# EAGLE board board (EAGLE 6.5.0), part 1 of 2
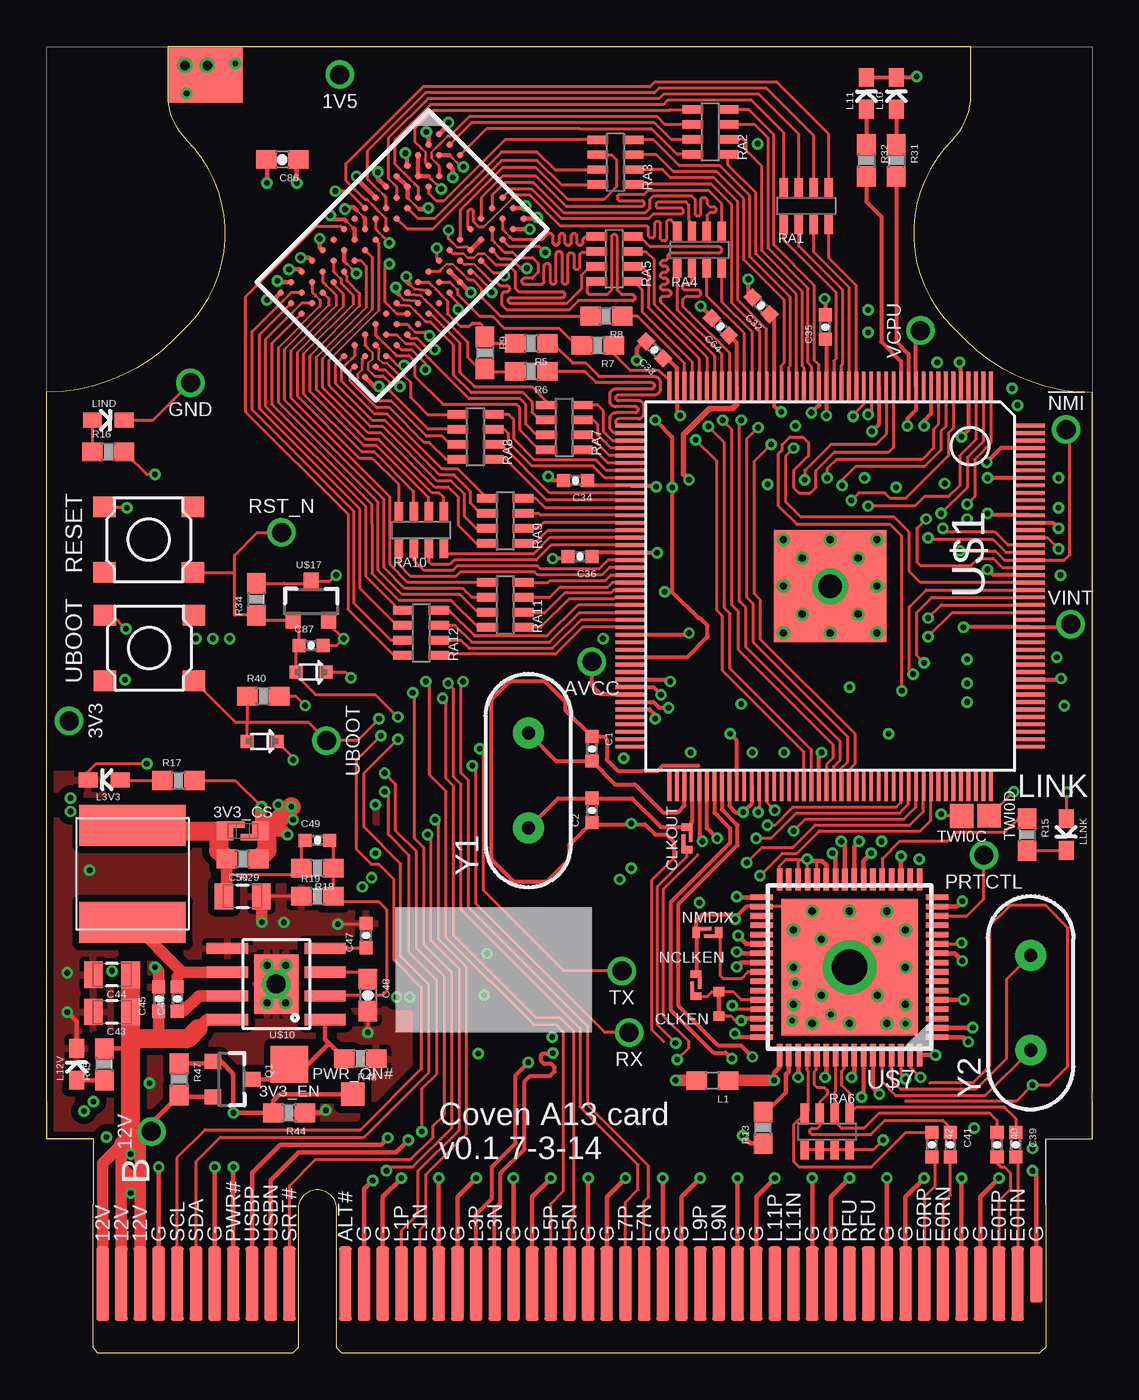
[diagram p3: board, top side]
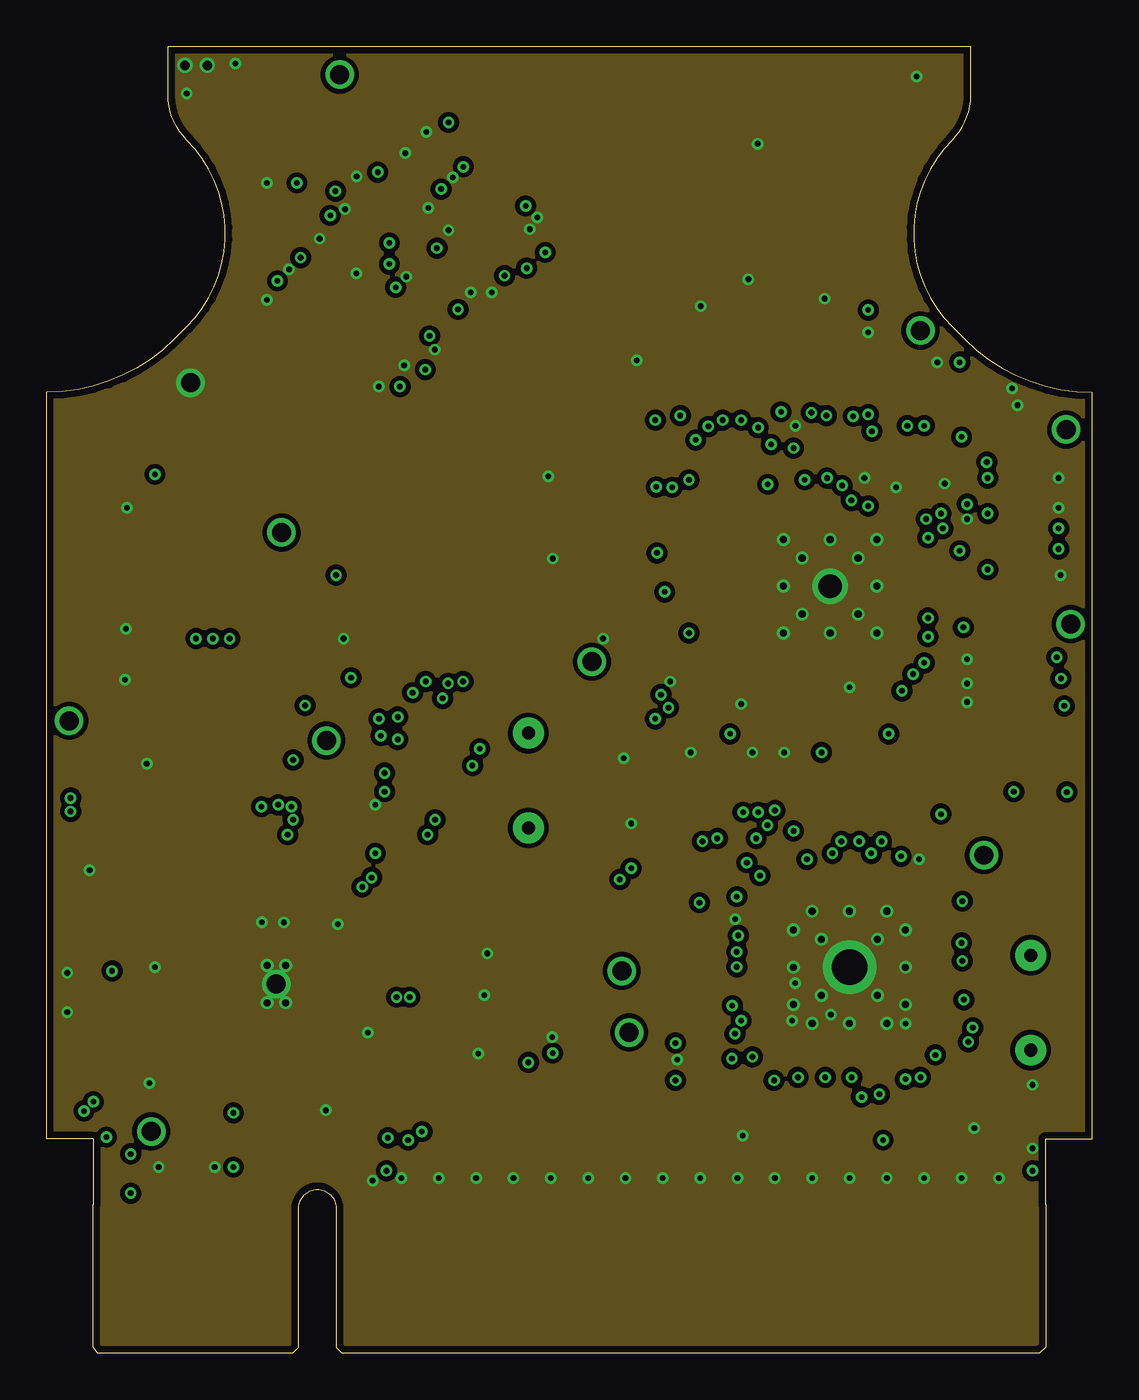
[diagram p4: board, inner layer Route2]
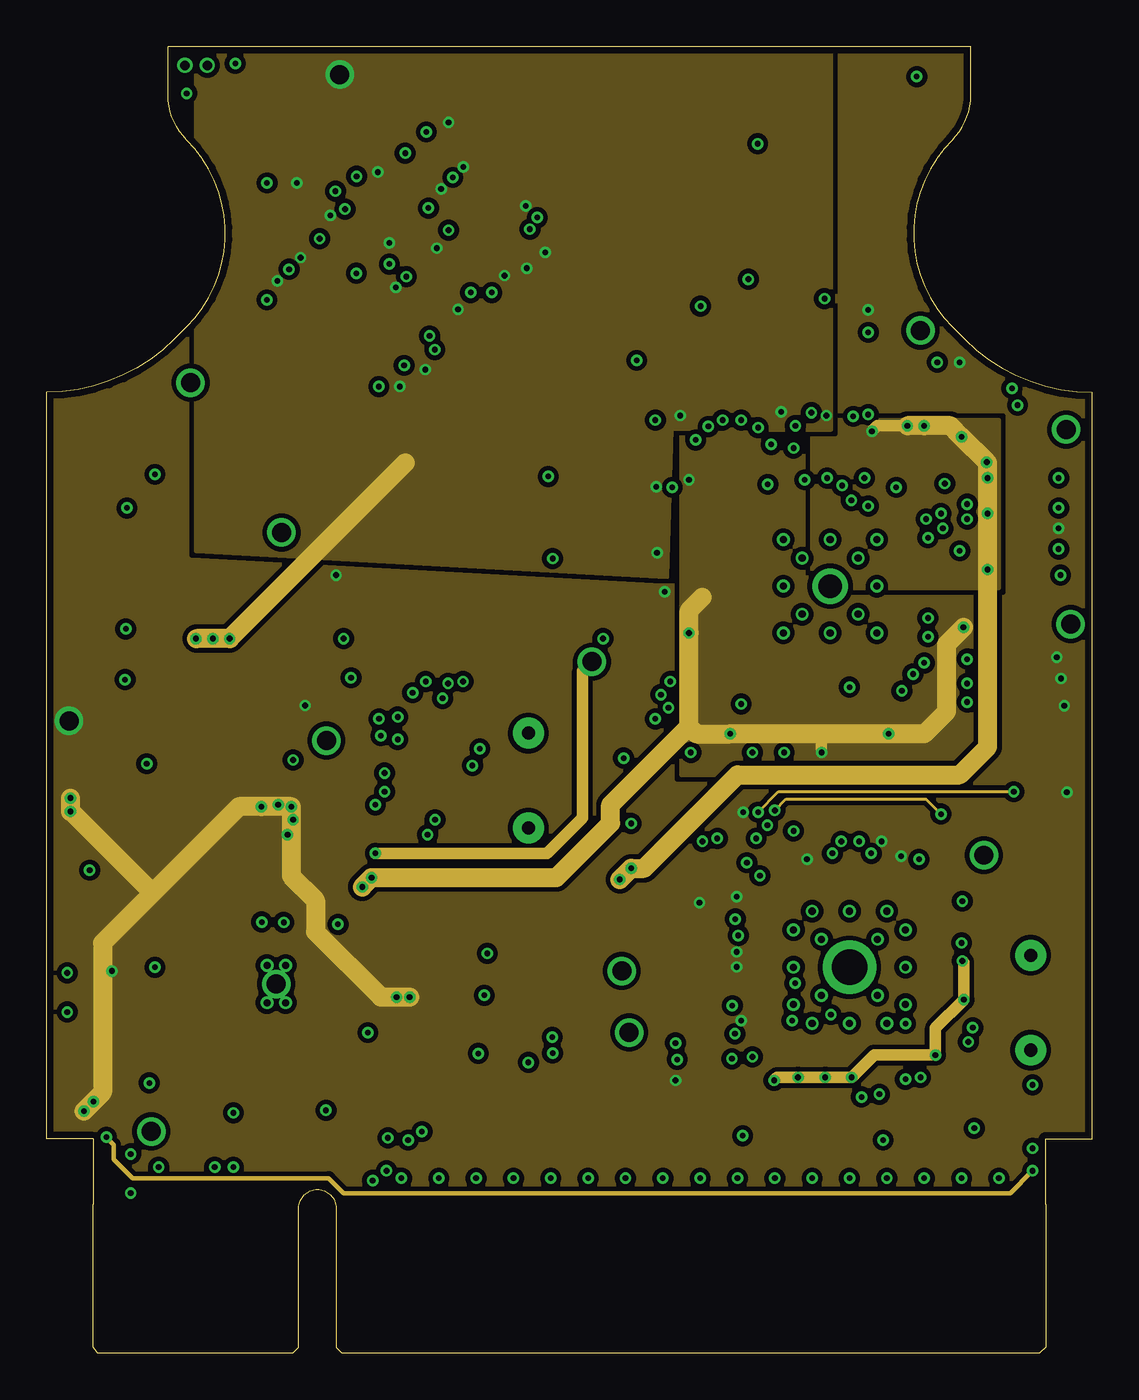
[diagram p5: board, inner layer Route15]
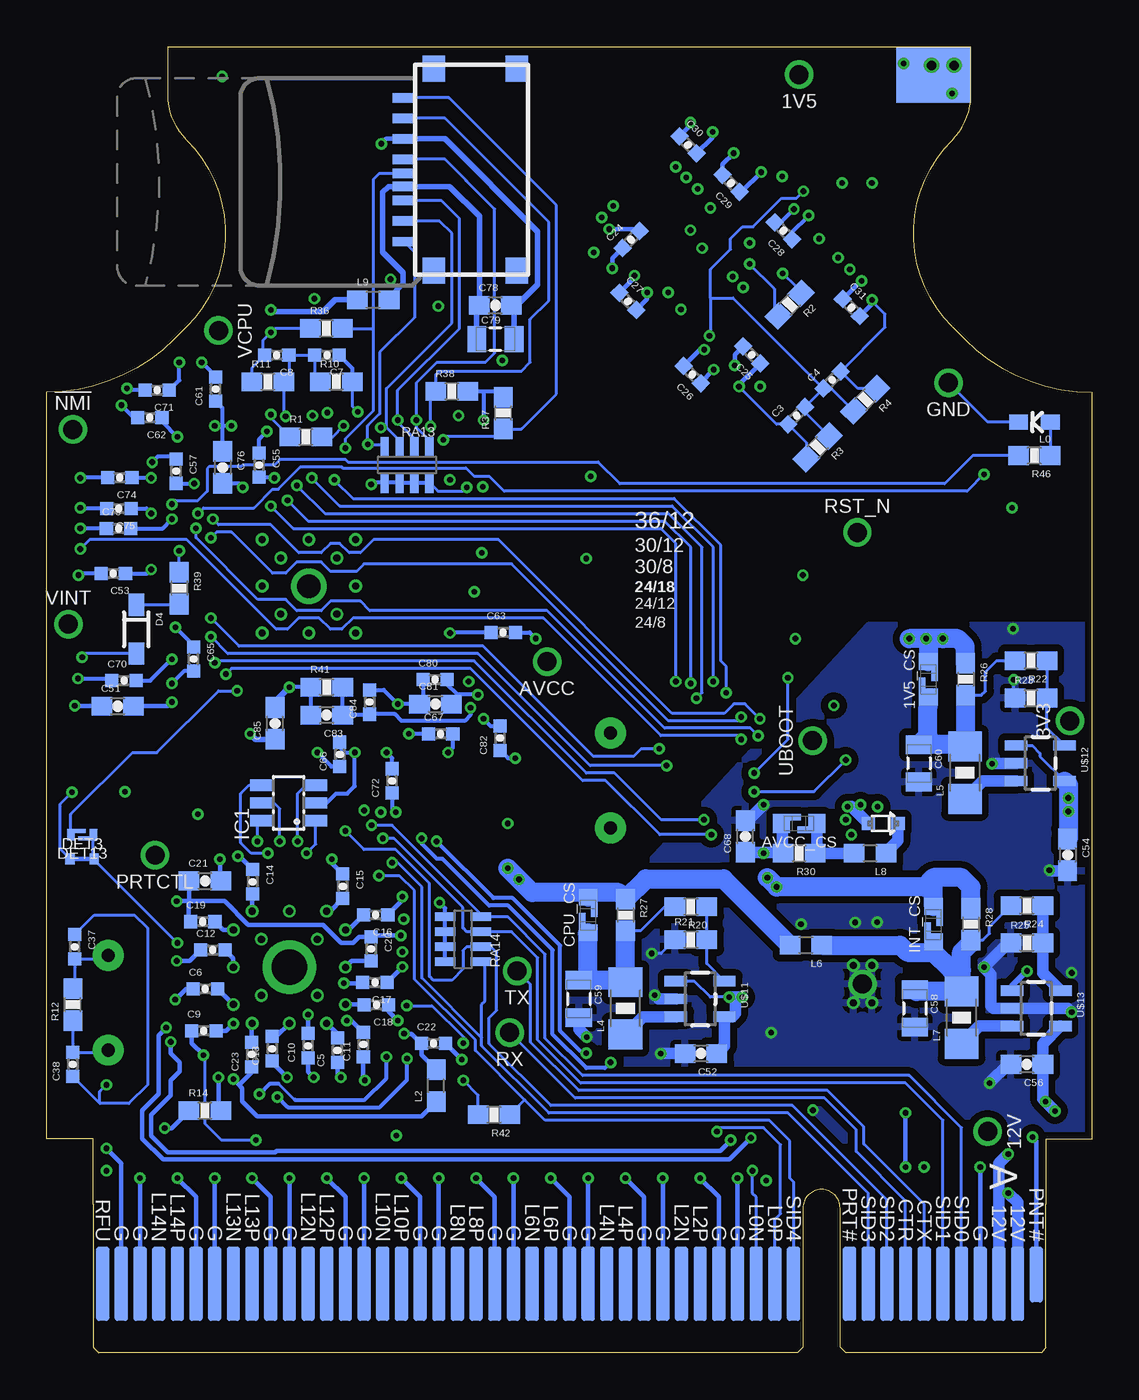
[diagram p6: board, bottom side, seen from below]

Size 56 x 69.95 mm. Coordinates in mm from the lower left corner, seen from the top.
Outline: 53.5,7.95 53.5,11.45 56,11.45 56,51.45 arc-45 49.17,54.28 48.5,54.95 arc-90 48.5,64.95 arc45 49.5,67.36 49.5,69.95 6.5,69.95 6.5,67.36 arc45 7.5,64.95 arc-90 7.5,54.95 6.83,54.28 arc-45 0,51.45 0,11.45 2.5,11.45 2.5,7.95
Copper layers (1*2*15*16): Top 0.035mm / dielectric 0.2mm / Route2 0.0175mm / dielectric 0.3mm / Route15 0.0175mm / dielectric 0.2mm / Bottom 0.035mm
Design rules "my_SeeedStudio_4layer_DRU_no_angle_20140221": minimum track width 6mil, minimum drill 12mil, track to track 6mil, track to pad 6mil, pad to pad 6mil, via to via 6mil, smd to smd 6mil, copper to edge 15mil, drill to drill 10mil, minimum pad ring 6mil, minimum via ring 6mil, stop-mask expansion 2mil, vias tented up to drill 12mil, thermal gap 10mil

## Footprints (pad centres in the part's own frame; a part is rotated, then mirrored left to right if it is on the bottom)
0402-CAP = smd 0.7 x 0.7: 1 -0.65,0; 2 0.65,0
0603-CAP = smd 1.1 x 1: 1 -0.85,0; 2 0.85,0
0805-CAP = smd 1 x 1.4: 1 -1,0; 2 1,0
HOLE_22AWG = drill 1.016: P 0,0
CLIP-AREA = smd 4 x 3: P$1 0,0 | smd 4 x 3 bottom: P$2 0,0
TESTPAD-1.27 = smd 1.27 x 1.27: P 0,0
TESTPAD-2MM = smd 2 x 2: P 0,0
SOD-523 = smd 0.7 x 0.7: A -0.8,0; C 0.8,0
SOD-323 = smd 1.2 x 0.83: A 1.3,0; C -1.3,0
BGA96 = smd 0.35 x 0.35: A1 -3.2,6; A2 -2.4,6; A3 -1.6,6; A7 1.6,6; A8 2.4,6; A9 3.2,6; B1 -3.2,5.2; B2 -2.4,5.2; B3 -1.6,5.2; B7 1.6,5.2; B8 2.4,5.2; B9 3.2,5.2; C1 -3.2,4.4; C2 -2.4,4.4; C3 -1.6,4.4; C7 1.6,4.4; C8 2.4,4.4; C9 3.2,4.4; D1 -3.2,3.6; D2 -2.4,3.6; D3 -1.6,3.6; D7 1.6,3.6; D8 2.4,3.6; D9 3.2,3.6; E1 -3.2,2.8; E2 -2.4,2.8; E3 -1.6,2.8; E7 1.6,2.8; E8 2.4,2.8; E9 3.2,2.8; F1 -3.2,2; F2 -2.4,2; F3 -1.6,2; F7 1.6,2; F8 2.4,2; F9 3.2,2; G1 -3.2,1.2; G2 -2.4,1.2; G3 -1.6,1.2; G7 1.6,1.2; G8 2.4,1.2; G9 3.2,1.2; H1 -3.2,0.4; H2 -2.4,0.4; H3 -1.6,0.4; H7 1.6,0.4; H8 2.4,0.4; H9 3.2,0.4; J1 -3.2,-0.4; J2 -2.4,-0.4; J3 -1.6,-0.4; J7 1.6,-0.4; J8 2.4,-0.4; J9 3.2,-0.4; K1 -3.2,-1.2; K2 -2.4,-1.2; K3 -1.6,-1.2; K7 1.6,-1.2; K8 2.4,-1.2; K9 3.2,-1.2; L1 -3.2,-2; L2 -2.4,-2; L3 -1.6,-2; L7 1.6,-2; L8 2.4,-2; L9 3.2,-2; M1 -3.2,-2.8; M2 -2.4,-2.8; M3 -1.6,-2.8; M7 1.6,-2.8; M8 2.4,-2.8; M9 3.2,-2.8; N1 -3.2,-3.6; N2 -2.4,-3.6; N3 -1.6,-3.6; N7 1.6,-3.6; N8 2.4,-3.6; N9 3.2,-3.6; P1 -3.2,-4.4; P2 -2.4,-4.4; P3 -1.6,-4.4; P7 1.6,-4.4; P8 2.4,-4.4; P9 3.2,-4.4; R1 -3.2,-5.2; R2 -2.4,-5.2; R3 -1.6,-5.2; R7 1.6,-5.2; R8 2.4,-5.2; R9 3.2,-5.2; T1 -3.2,-6; T2 -2.4,-6; T3 -1.6,-6; T7 1.6,-6; T8 2.4,-6; T9 3.2,-6
SOT23-6L = smd 0.6 x 1.2: 1 -0.95,-1.45; 2 0,-1.45; 3 0.95,-1.45; 4 0.95,1.45; 5 0,1.45; 6 -0.95,1.45
0603_LED = smd 0.8 x 1.003: A 0,-0.852; C 0,0.852
0603 = smd 1.1 x 1: 1 -0.85,0; 2 0.85,0
NR60XX = smd 2.2 x 5.7: P$1 2.6,0; P$2 -2.6,0
1206 = smd 1.6 x 1.8: 1 -1.4,0; 2 1.4,0
SOT23-3 = smd 0.8 x 0.9: 1 -0.95,-1; 2 0.95,-1; 3 0,1.1
0603-RES = smd 1.1 x 1: 1 -0.85,0; 2 0.85,0
0603-ARV = smd 0.45 x 1.1: 1 -1.2,-0.95; 2 -0.4,-0.95; 3 0.4,-0.95; 4 1.2,-0.95; 5 1.2,0.95; 6 0.4,0.95; 7 -0.4,0.95; 8 -1.2,0.95
TAC_SWITCH_SMD_4.5X4.5 = smd 1.2 x 1.1: 1 -2.375,1.75; 2 2.375,1.75; 3 -2.375,-1.75; 4 2.375,-1.75
SOLDER-BRIDGE-OPEN = smd 0.4 x 0.6: L1 -0.6,0; R1 0.6,0 | smd 0.6 x 0.2: L2 -0.1,0.2; R2 0.1,-0.2
TRACE-CUT = smd 0.5 x 0.6: L1 -0.65,0; R1 0.65,0
SOLDER-BRIDGE-OPEN-LARGE = smd 0.9 x 1: L1 -0.95,0; R1 0.95,0 | smd 0.6 x 0.35: L2 -0.2,0.325; R2 0.2,-0.325
TQFP176_0.4 = smd 1.6 x 0.2: 001 -10.7,8.6; 002 -10.7,8.2; 003 -10.7,7.8; 004 -10.7,7.4; 005 -10.7,7; 006 -10.7,6.6; 007 -10.7,6.2; 008 -10.7,5.8; 009 -10.7,5.4; 010 -10.7,5; 011 -10.7,4.6; 012 -10.7,4.2; 013 -10.7,3.8; 014 -10.7,3.4; 015 -10.7,3; 016 -10.7,2.6; 017 -10.7,2.2; 018 -10.7,1.8; 019 -10.7,1.4; 020 -10.7,1; 021 -10.7,0.6; 022 -10.7,0.2; 023 -10.7,-0.2; 024 -10.7,-0.6; 025 -10.7,-1; 026 -10.7,-1.4; 027 -10.7,-1.8; 028 -10.7,-2.2; 029 -10.7,-2.6; 030 -10.7,-3; 031 -10.7,-3.4; 032 -10.7,-3.8; 033 -10.7,-4.2; 034 -10.7,-4.6; 035 -10.7,-5; 036 -10.7,-5.4; 037 -10.7,-5.8; 038 -10.7,-6.2; 039 -10.7,-6.6; 040 -10.7,-7; 041 -10.7,-7.4; 042 -10.7,-7.8; 043 -10.7,-8.2; 044 -10.7,-8.6; 089 10.7,-8.6; 090 10.7,-8.2; 091 10.7,-7.8; 092 10.7,-7.4; 093 10.7,-7; 094 10.7,-6.6; 095 10.7,-6.2; 096 10.7,-5.8; 097 10.7,-5.4; 098 10.7,-5; 099 10.7,-4.6; 100 10.7,-4.2; 101 10.7,-3.8; 102 10.7,-3.4; 103 10.7,-3; 104 10.7,-2.6; 105 10.7,-2.2; 106 10.7,-1.8; 107 10.7,-1.4; 108 10.7,-1; 109 10.7,-0.6; 110 10.7,-0.2; 111 10.7,0.2; 112 10.7,0.6; 113 10.7,1; 114 10.7,1.4; 115 10.7,1.8; 116 10.7,2.2; 117 10.7,2.6; 118 10.7,3; 119 10.7,3.4; 120 10.7,3.8; 121 10.7,4.2; 122 10.7,4.6; 123 10.7,5; 124 10.7,5.4; 125 10.7,5.8; 126 10.7,6.2; 127 10.7,6.6; 128 10.7,7; 129 10.7,7.4; 130 10.7,7.8; 131 10.7,8.2; 132 10.7,8.6 | smd 0.2 x 1.6: 045 -8.6,-10.7; 046 -8.2,-10.7; 047 -7.8,-10.7; 048 -7.4,-10.7; 049 -7,-10.7; 050 -6.6,-10.7; 051 -6.2,-10.7; 052 -5.8,-10.7; 053 -5.4,-10.7; 054 -5,-10.7; 055 -4.6,-10.7; 056 -4.2,-10.7; 057 -3.8,-10.7; 058 -3.4,-10.7; 059 -3,-10.7; 060 -2.6,-10.7; 061 -2.2,-10.7; 062 -1.8,-10.7; 063 -1.4,-10.7; 064 -1,-10.7; 065 -0.6,-10.7; 066 -0.2,-10.7; 067 0.2,-10.7; 068 0.6,-10.7; 069 1,-10.7; 070 1.4,-10.7; 071 1.8,-10.7; 072 2.2,-10.7; 073 2.6,-10.7; 074 3,-10.7; 075 3.4,-10.7; 076 3.8,-10.7; 077 4.2,-10.7; 078 4.6,-10.7; 079 5,-10.7; 080 5.4,-10.7; 081 5.8,-10.7; 082 6.2,-10.7; 083 6.6,-10.7; 084 7,-10.7; 085 7.4,-10.7; 086 7.8,-10.7; 087 8.2,-10.7; 088 8.6,-10.7; 133 8.6,10.7; 134 8.2,10.7; 135 7.8,10.7; 136 7.4,10.7; 137 7,10.7; 138 6.6,10.7; 139 6.2,10.7; 140 5.8,10.7; 141 5.4,10.7; 142 5,10.7; 143 4.6,10.7; 144 4.2,10.7; 145 3.8,10.7; 146 3.4,10.7; 147 3,10.7; 148 2.6,10.7; 149 2.2,10.7; 150 1.8,10.7; 151 1.4,10.7; 152 1,10.7; 153 0.6,10.7; 154 0.2,10.7; 155 -0.2,10.7; 156 -0.6,10.7; 157 -1,10.7; 158 -1.4,10.7; 159 -1.8,10.7; 160 -2.2,10.7; 161 -2.6,10.7; 162 -3,10.7; 163 -3.4,10.7; 164 -3.8,10.7; 165 -4.2,10.7; 166 -4.6,10.7; 167 -5,10.7; 168 -5.4,10.7; 169 -5.8,10.7; 170 -6.2,10.7; 171 -6.6,10.7; 172 -7,10.7; 173 -7.4,10.7; 174 -7.8,10.7; 175 -8.2,10.7; 176 -8.6,10.7 | drill 1.27: P$1 0,0 | drill 0.381: P$2 -2.5,2.5; P$3 0,2.5; P$4 2.5,2.5; P$5 2.5,-2.5; P$6 1.5,-1.5; P$7 0,-2.5; P$8 -1.5,-1.5; P$9 -1.5,1.5; P$10 1.5,1.5; P$11 2.5,0; P$12 -2.5,-2.5; P$13 -2.5,0 | smd 6 x 6: PAD 0,0
QFN64 = smd 1.2 x 0.3: 001 -4.7,3.75; 002 -4.7,3.25; 003 -4.7,2.75; 004 -4.7,2.25; 005 -4.7,1.75; 006 -4.7,1.25; 007 -4.7,0.75; 008 -4.7,0.25; 009 -4.7,-0.25; 010 -4.7,-0.75; 011 -4.7,-1.25; 012 -4.7,-1.75; 013 -4.7,-2.25; 014 -4.7,-2.75; 015 -4.7,-3.25; 016 -4.7,-3.75; 033 4.7,-3.75; 034 4.7,-3.25; 035 4.7,-2.75; 036 4.7,-2.25; 037 4.7,-1.75; 038 4.7,-1.25; 039 4.7,-0.75; 040 4.7,-0.25; 041 4.7,0.25; 042 4.7,0.75; 043 4.7,1.25; 044 4.7,1.75; 045 4.7,2.25; 046 4.7,2.75; 047 4.7,3.25; 048 4.7,3.75 | smd 0.3 x 1.2: 017 -3.75,-4.7; 018 -3.25,-4.7; 019 -2.75,-4.7; 020 -2.25,-4.7; 021 -1.75,-4.7; 022 -1.25,-4.7; 023 -0.75,-4.7; 024 -0.25,-4.7; 025 0.25,-4.7; 026 0.75,-4.7; 027 1.25,-4.7; 028 1.75,-4.7; 029 2.25,-4.7; 030 2.75,-4.7; 031 3.25,-4.7; 032 3.75,-4.7; 049 3.75,4.7; 050 3.25,4.7; 051 2.75,4.7; 052 2.25,4.7; 053 1.75,4.7; 054 1.25,4.7; 055 0.75,4.7; 056 0.25,4.7; 057 -0.25,4.7; 058 -0.75,4.7; 059 -1.25,4.7; 060 -1.75,4.7; 061 -2.25,4.7; 062 -2.75,4.7; 063 -3.25,4.7; 064 -3.75,4.7 | drill 1.905: P$1 0,0 | drill 0.381: P$2 0,3; P$3 -2,3; P$4 -3,0; P$5 0,-3; P$6 3,0; P$7 2,3; P$8 2,-3; P$9 -2,-3; P$10 -3,2; P$11 -3,-2; P$12 3,-2; P$13 3,2; P$14 -1.5,1.5; P$15 1.5,1.5; P$16 1.5,-1.5; P$17 -1.5,-1.5 | smd 7.3 x 7.3: PAD 0,0
HTSOP8 = smd 0.61 x 2.21: 1 -1.905,-2.616; 2 -0.635,-2.616; 3 0.635,-2.616; 4 1.905,-2.616; 5 1.905,2.616; 6 0.635,2.616; 7 -0.635,2.616; 8 -1.905,2.616 | drill 1.016: P$1 0,0 | drill 0.381: P$2 -1,0.5; P$3 -1,-0.5; P$4 1,-0.5; P$5 1,0.5 | smd 3.2 x 2.4: PAD 0,0
SOT23-5 = smd 0.55 x 1.2: 1 -0.95,-1.3; 2 0,-1.3; 3 0.95,-1.3; 4 0.95,1.3; 5 -0.95,1.3
MICROSD-MOLEX-1050270001 = smd 0.5 x 1.2: G1 0.2,-6.65; P1 3.85,-6.65; P2 2.75,-6.65; P3 1.65,-6.65; P4 0.9,-6.65; P5 -0.55,-6.65; P6 -1.65,-6.65; P7 -2.75,-6.65; P8 -3.85,-6.65 | smd 1.4 x 1.2: SHELL1 -5.4,-0.6; SHELL2 5.4,-0.6; SHELL3 5.4,-5.05; SHELL4 -5.4,-5.05
CVN-V1-EDGE = smd 0.7 x 3 bottom: A1 -11.5,-0.25 | smd 0.7 x 4 bottom: A2 -10.5,-0.75; A3 -9.5,-0.75; A4 -8.5,-0.75; A5 -7.5,-0.75; A6 -6.5,-0.75; A7 -5.5,-0.75; A8 -4.5,-0.75; A9 -3.5,-0.75; A10 -2.5,-0.75; A11 -1.5,-0.75; A12 1.5,-0.75; A13 2.5,-0.75; A14 3.5,-0.75; A15 4.5,-0.75; A16 5.5,-0.75; A17 6.5,-0.75; A18 7.5,-0.75; A19 8.5,-0.75; A20 9.5,-0.75; A21 10.5,-0.75; A22 11.5,-0.75; A23 12.5,-0.75; A24 13.5,-0.75; A25 14.5,-0.75; A26 15.5,-0.75; A27 16.5,-0.75; A28 17.5,-0.75; A29 18.5,-0.75; A30 19.5,-0.75; A31 20.5,-0.75; A32 21.5,-0.75; A33 22.5,-0.75; A34 23.5,-0.75; A35 24.5,-0.75; A36 25.5,-0.75; A37 26.5,-0.75; A38 27.5,-0.75; A39 28.5,-0.75; A40 29.5,-0.75; A41 30.5,-0.75; A42 31.5,-0.75; A43 32.5,-0.75; A44 33.5,-0.75; A45 34.5,-0.75; A46 35.5,-0.75; A47 36.5,-0.75; A48 37.5,-0.75; A49 38.5,-0.75 | smd 0.7 x 4: B1 -11.5,-0.75; B2 -10.5,-0.75; B3 -9.5,-0.75; B4 -8.5,-0.75; B5 -7.5,-0.75; B6 -6.5,-0.75; B7 -5.5,-0.75; B8 -4.5,-0.75; B9 -3.5,-0.75; B10 -2.5,-0.75; B11 -1.5,-0.75; B12 1.5,-0.75; B13 2.5,-0.75; B14 3.5,-0.75; B15 4.5,-0.75; B16 5.5,-0.75; B17 6.5,-0.75; B18 7.5,-0.75; B19 8.5,-0.75; B20 9.5,-0.75; B21 10.5,-0.75; B22 11.5,-0.75; B23 12.5,-0.75; B24 13.5,-0.75; B25 14.5,-0.75; B26 15.5,-0.75; B27 16.5,-0.75; B28 17.5,-0.75; B29 18.5,-0.75; B30 19.5,-0.75; B31 20.5,-0.75; B32 21.5,-0.75; B33 22.5,-0.75; B34 23.5,-0.75; B35 24.5,-0.75; B36 25.5,-0.75; B37 26.5,-0.75; B38 27.5,-0.75; B39 28.5,-0.75; B40 29.5,-0.75; B41 30.5,-0.75; B42 31.5,-0.75; B43 32.5,-0.75; B44 33.5,-0.75; B45 34.5,-0.75; B46 35.5,-0.75; B47 36.5,-0.75; B48 37.5,-0.75 | smd 0.7 x 3: B49 38.5,-0.25
HC49US = drill 0.7 pad 1.651: 1 -2.54,0; 2 2.54,0

## Placement (x,y rotation side)
C1  22pF  [0402-CAP]  29.2,32.35 270 top
C2  22pF  [0402-CAP]  29.2,29.05 90 top
C3  0.1uF  [0402-CAP]  15.84,50.19 45 bottom
C4  0.1uF  [0402-CAP]  13.93,52.1 45 bottom
C5  0.1uF  [0402-CAP]  40.43,16.21 90 bottom
C6  0.1uF  [0402-CAP]  47.5,19.49 0 bottom
C7  0.1uF  [0402-CAP]  40.99,53.43 180 bottom
C8  0.1uF  [0402-CAP]  43.68,53.43 180 bottom
C9  0.1uF  [0402-CAP]  47.58,17.25 0 bottom
C10  0.1uF  [0402-CAP]  42,16.45 90 bottom
C11  0.1uF  [0402-CAP]  39.04,16.51 90 bottom
C12  0.1uF  [0402-CAP]  47.1,21.57 0 bottom
C13  0.1uF  [0402-CAP]  43.92,16.29 90 bottom
C14  0.1uF  [0402-CAP]  44.96,25.23 270 bottom
C15  0.1uF  [0402-CAP]  40.14,24.99 270 bottom
C16  0.1uF  [0402-CAP]  38.38,23.45 180 bottom
C17  0.1uF  [0402-CAP]  38.42,19.83 180 bottom
C18  0.1uF  [0402-CAP]  38.34,18.63 180 bottom
C19  0.1uF  [0402-CAP]  47.64,23.09 0 bottom
C20  0.1uF  [0402-CAP]  38.62,21.63 270 bottom
C21  4.7uF  [0603-CAP]  47.52,25.27 0 bottom
C22  0.1uF  [0402-CAP]  35.28,16.57 0 bottom
C23  1uF  [0402-CAP]  45.02,15.97 90 bottom
C24  0.1uF  [0402-CAP]  24.7,59.62 45 bottom
C25  1uF  [0402-CAP]  18.24,53.45 135 bottom
C26  0.1uF  [0402-CAP]  21.42,52.38 135 bottom
C27  0.1uF  [0402-CAP]  24.87,56.31 315 bottom
C28  0.1uF  [0402-CAP]  16.54,60.09 135 bottom
C29  0.1uF  [0402-CAP]  19.35,62.63 135 bottom
C30  0.1uF  [0402-CAP]  21.65,64.69 315 bottom
C31  1uF  [0402-CAP]  12.91,55.98 315 bottom
C32  0.1uF  [0402-CAP]  38.26,56.08 135 top
C33  0.1uF  [0402-CAP]  32.56,53.71 135 top
C34  0.1uF  [0402-CAP]  28.32,46.72 180 top
C35  0.1uF  [0402-CAP]  41.7,54.94 90 top
C36  0.1uF  [0402-CAP]  28.56,42.64 180 top
C37  22pF  [0402-CAP]  54.5,21.75 270 bottom
C38  22pF  [0402-CAP]  54.6,15.45 90 bottom
C39  0.1uF  [0402-CAP]  51.9,11.15 270 top
C40  0.1uF  [0402-CAP]  50.9,11.15 270 top
C41  0.1uF  [0402-CAP]  48.4,11.15 270 top
C42  0.1uF  [0402-CAP]  47.4,11.15 270 top
C43  10uF  [0805-CAP]  3.5,18.25 180 top
C44  10uF  [0805-CAP]  3.5,20.25 180 top
C45  0.1uF  [0402-CAP]  6,18.95 90 top
C46  0.1uF  [0402-CAP]  7,18.95 90 top
C47  3300pF  [0402-CAP]  17.1,22.35 90 top
C48  1uF  [0603-CAP]  17.2,19.15 270 top
C49  5pF-100pF;optional  [0402-CAP]  14.5,27.45 0 top
C50  22uF  [0805-CAP]  10.5,24.45 0 top
C51  4.7uF  [0603-CAP]  52.2,34.63 0 bottom
C52  10uF  [0603-CAP]  20.96,16.03 180 bottom
C53  0.1uF  [0402-CAP]  52.43,41.74 180 bottom
C54  10uF  [0603-CAP]  1.32,26.67 270 bottom
C55  0.1uF  [0402-CAP]  44.62,47.54 270 bottom
C56  10uF  [0603-CAP]  3.5,15.45 180 bottom
C57  0.1uF  [0402-CAP]  49.07,47.21 270 bottom
C58  22uF  [0805-CAP]  9.5,18.45 270 bottom
C59  22uF  [0805-CAP]  27.5,18.95 270 bottom
C60  22uF  [0805-CAP]  9.28,31.57 270 bottom
C61  0.1uF  [0402-CAP]  46.96,51.61 90 bottom
C62  0.1uF  [0402-CAP]  50.48,50.08 180 bottom
C63  0.1uF  [0402-CAP]  31.55,38.58 0 bottom
C64  0.1uF  [0402-CAP]  36.08,54.96 135 top
C65  0.1uF  [0402-CAP]  48.13,37.16 270 bottom
C66  0.1uF  [0402-CAP]  40.3,32.05 90 bottom
C67  0.1uF  [0402-CAP]  34.9,33.15 0 bottom
C68  10uF  [0603-CAP]  18.58,27.65 90 bottom
C70  0.1uF  [0402-CAP]  51.86,36 0 bottom
C71  0.1uF  [0402-CAP]  50.08,51.55 180 bottom
C72  0.1uF  [0402-CAP]  37.5,30.63 90 bottom
C73  0.1uF  [0402-CAP]  52.15,44.15 0 bottom
C74  0.1uF  [0402-CAP]  52.09,46.87 180 bottom
C75  0.1uF  [0402-CAP]  52.13,45.21 180 bottom
C76  4.7uF  [0603-CAP]  46.57,47.42 270 bottom
C78  10uF  [0603-CAP]  31.97,56.09 0 bottom
C79  22uF  [0805-CAP]  31.97,54.29 0 bottom
C80  0.1uF  [0402-CAP]  35.2,36.05 0 bottom
C81  10uF  [0603-CAP]  35.18,34.74 0 bottom
C82  1uF  [0402-CAP]  31.72,32.92 90 bottom
C83  10uF  [0603-CAP]  41,34.15 180 bottom
C84  0.1uF  [0402-CAP]  38.7,34.85 90 bottom
C85  4.7uF  [0603-CAP]  43.77,33.71 90 bottom
C86  4.7uF  [0603-CAP]  12.62,63.9 180 top
C87  0.1uF  [0402-CAP]  14.16,37.87 0 top
CONN1  3V3  [HOLE_22AWG]  1.2,33.85 90 top
CONN2  VCPU  [HOLE_22AWG]  46.8,54.75 270 top
CONN3  VINT  [HOLE_22AWG]  54.84,39.02 180 top
CONN4  1V5  [HOLE_22AWG]  15.7,68.45 0 top
CONN5  GND  [HOLE_22AWG]  7.7,51.95 0 top
CONN6  12V  [HOLE_22AWG]  5.6,11.85 270 top
CONN7  AVCC  [HOLE_22AWG]  29.2,37.01 0 top
CONN8  gnd  [CLIP-AREA]  8.5,68.45 0 top
CONN9  PRTCTL  [HOLE_22AWG]  50.2,26.65 0 top
CONN10  TX  [HOLE_22AWG]  30.8,20.45 0 top
CONN11  UBOOT  [HOLE_22AWG]  14.98,32.79 90 top
CONN12  PWR_ON#  [TESTPAD-1.27]  16.4,13.85 180 top
CONN13  3V3_EN  [TESTPAD-2MM]  13,15.45 0 top
CONN14  !NMI  [HOLE_22AWG]  54.6,49.45 180 top
CONN15  TWI0C  [TESTPAD-1.27]  49,28.75 0 top
CONN16  TWI0D  [TESTPAD-1.27]  50.48,28.77 90 top
CONN17  RST_N  [HOLE_22AWG]  12.58,43.93 180 top
CONN18  RX  [HOLE_22AWG]  31.2,17.15 0 top
D1  RB521S30  [SOD-523]  14.16,36.45 0 top
D2  RB521S30  [SOD-523]  11.54,32.75 0 top
D4  B5819WS  [SOD-323]  51.2,38.75 270 bottom
D6  PMEG2010AEB  [SOD-523]  11.2,28.35 0 bottom
DDR3_1  x16, 96FBGA: AS4C{64/128/256}M16D3  [BGA96]  19.03,58.76 315 top
IC1  256/512 x 8bit  [SOT23-6L]  43.04,29.45 90 bottom
L0  WHT  [0603_LED]  3.1,49.85 90 bottom
L1  2A,120R@100MHz  [0603]  35.66,14.57 180 top
L2  2A,120R@100MHz  [0603]  35.14,14.31 90 bottom
L3  3.5A,2.2uH:NR6028T3R0N  [NR60XX]  4.6,25.65 270 top
L3V3  GRN  [0603_LED]  3.08,30.69 90 top
L4  1.5A,2.2uH:BRL3225T2R2M  [1206]  25,18.45 90 bottom
L5  1.5A,2.2uH:BRL3225T2R2M  [1206]  6.82,31.07 90 bottom
L6  DNP(2A,120R@100MHz)  [0603]  15.34,21.83 180 bottom
L7  1.5A,2.2uH:BRL3225T2R2M  [1206]  7,17.95 90 bottom
L8  2A,120R@100MHz  [0603]  11.9,26.75 180 bottom
L9  CIC10J601(750mA,600R)  [0603]  38.51,56.39 0 bottom
L10  GRN  [0603_LED]  45.5,67.45 0 top
L11  YLW  [0603_LED]  43.9,67.45 0 top
L12V  YLW  [0603_LED]  1.6,15.45 0 top
LIND  BLU  [0603_LED]  3.3,49.95 270 top
LLNK  GRN  [0603_LED]  54.6,27.75 180 top
Q1  2N7002  [SOT23-3]  9.9,14.65 270 top
R1  240R 1%  [0603-RES]  42.12,49.05 0 bottom
R2  240R 1%  [0603-RES]  16.21,56.14 225 bottom
R3  1k 1%  [0603-RES]  14.71,48.5 225 bottom
R4  1k 1%  [0603-RES]  12.16,51.04 225 bottom
R5  22R  [0603-RES]  25.96,54.06 180 top
R6  22R  [0603-RES]  25.96,52.56 180 top
R7  22R  [0603-RES]  29.52,53.95 180 top
R8  22R  [0603-RES]  29.98,55.52 180 top
R9  100R  [0603-RES]  23.46,53.56 270 top
R10  1k 1%  [0603-RES]  40.48,52.01 0 bottom
R11  1k 1%  [0603-RES]  44.15,52 0 bottom
R12  1M  [0603-RES]  54.6,18.65 90 bottom
R13  12.4K 1%  [0603-RES]  38.38,12.05 90 top
R14  12K 1%  [0603-RES]  47.52,12.97 0 bottom
R15  330R  [0603-RES]  52.5,27.75 270 top
R16  1k  [0603-RES]  3.3,48.25 0 top
R17  680R  [0603-RES]  7.06,30.65 0 top
R18  33k 1%  [0603-RES]  14.5,25.95 180 top
R19  10k 1%  [0603-RES]  14.5,24.45 0 top
R20  10k/12k 1%  [0603-RES]  21.5,23.89 180 bottom
R21  10k 1%  [0603-RES]  21.5,22.13 0 bottom
R22  15k 1%  [0603-RES]  3.28,37.07 180 bottom
R23  10k 1%  [0603-RES]  3.28,35.07 0 bottom
R24  10k/12k 1%  [0603-RES]  3.5,23.95 180 bottom
R25  10k 1%  [0603-RES]  3.5,21.95 0 bottom
R26  0.01R  [0603-RES]  6.78,36.07 270 bottom
R27  0.01R  [0603-RES]  25,23.45 270 bottom
R28  0.01R  [0603-RES]  6.5,22.95 270 bottom
R29  0.01R  [0603-RES]  10.5,26.45 180 top
R30  0.01R  [0603-RES]  15.7,26.75 180 bottom
R31  470R  [0603-RES]  45.5,63.85 270 top
R32  470R  [0603-RES]  43.9,63.85 270 top
R34  10k  [0603-RES]  11.24,40.35 90 top
R36  10k  [0603-RES]  41.02,54.86 0 bottom
R37  47k  [0603-RES]  31.54,50.33 90 bottom
R38  47k  [0603-RES]  34.3,51.49 0 bottom
R39  47k  [0603-RES]  48.9,40.95 270 bottom
R40  100k  [0603-RES]  11.6,35.17 0 top
R41  200k 1%  [0603-RES]  41,35.65 0 bottom
R42  10k  [0603-RES]  32.04,12.75 180 bottom
R44  100k  [0603-RES]  12.98,12.85 180 top
R45  4.7k  [0603-RES]  3.1,15.45 90 top
R46  1k  [0603-RES]  3.1,48.05 180 bottom
R47  330k  [0603-RES]  7.1,14.65 270 top
R48  DNP  [0603-RES]  16.8,15.75 180 top
RA1  22R  [0603-ARV]  40.68,61.42 0 top
RA2  22R  [0603-ARV]  35.54,65.38 90 top
RA3  22R  [0603-ARV]  30.46,63.76 90 top
RA4  22R  [0603-ARV]  34.96,59.07 0 top
RA5  22R  [0603-ARV]  30.4,58.59 90 top
RA6  49.9R 1%  [0603-ARV]  41.8,11.85 180 top
RA7  22R  [0603-ARV]  27.72,49.56 90 top
RA8  22R  [0603-ARV]  22.96,49.06 90 top
RA9  22R  [0603-ARV]  24.56,44.56 90 top
RA10  22R  [0603-ARV]  20.06,44.06 0 top
RA11  22R  [0603-ARV]  24.56,40.06 90 top
RA12  22R  [0603-ARV]  20.06,38.56 90 top
RA13  47k  [0603-ARV]  36.7,47.55 180 bottom
RA14  10k  [0603-ARV]  33.7,22.15 90 bottom
S_RESET  TAC_SWITCHSMD_4.5X4.5  [TAC_SWITCH_SMD_4.5X4.5]  5.46,43.55 0 top
SB1  NMDIX  [SOLDER-BRIDGE-OPEN]  35.4,22.51 0 top
SB3  NCLKEN  [SOLDER-BRIDGE-OPEN]  34.78,19.69 270 top
SB4  CLKEN  [TRACE-CUT]  36,18.69 90 top
SB5  CLKOUT  [SOLDER-BRIDGE-OPEN]  34.3,27.55 270 top
SB6  DET13  [SOLDER-BRIDGE-OPEN]  54.1,27.75 0 bottom
SB7  DET3  [TRACE-CUT]  54.1,26.45 0 bottom
SB8  3V3_CS  [SOLDER-BRIDGE-OPEN-LARGE]  10.5,27.95 0 top
SB9  CPU_CS  [SOLDER-BRIDGE-OPEN-LARGE]  27,23.45 90 bottom
SB10  1V5_CS  [SOLDER-BRIDGE-OPEN-LARGE]  8.78,36.07 90 bottom
SB11  AVCC_CS  [SOLDER-BRIDGE-OPEN-LARGE]  15.7,28.35 180 bottom
SB12  INT_CS  [SOLDER-BRIDGE-OPEN-LARGE]  8.5,22.95 90 bottom
SW_UBOOT  TAC_SWITCHSMD_4.5X4.5  [TAC_SWITCH_SMD_4.5X4.5]  5.5,37.75 0 top
U$1  A13  [TQFP176_0.4]  41.96,41.06 270 top
U$7  LAN9512  [QFN64]  43,20.65 180 top
U$10  BD9D321EFJ  [HTSOP8]  12.3,19.75 90 top
U$11  AP3418  [SOT23-5]  21,18.95 270 bottom
U$12  AP3418  [SOT23-5]  2.78,31.57 270 bottom
U$13  AP3418  [SOT23-5]  3,18.45 270 bottom
U$15  Molex 1050270001  [MICROSD-MOLEX-1050270001]  30.22,63.36 270 bottom
U$16  CVN-V1EDGE  [CVN-V1-EDGE]  14.5,4.45 0 top
U$17  RT9818C-29GV  [SOT23-3]  14.16,40.23 0 top
Y1  24MHz  [HC49US]  25.8,30.65 90 top
Y2  25MHz  [HC49US]  52.7,18.75 90 top

## Tracks (layer width: path | path; a pad name or v marks a point on that pad's centre or on a via)
1.5V  (via drill 0.3)
  Top 0.127: 16.43,60.23 16.04,60.63 | 18.86,56.67 19.15,56.39
  Top 0.14: 17.79,60.01 18.02,59.78 | 20.62,62.84 20.84,62.61 | 21.75,63.97 21.98,63.74
  Top 0.152: C35.1 41.76,54.23 | 41.76,54.23 | 18.92,51.86 18.13,52.65 17.79,52.65 DDR3_1.R9 | v20.28,52.65 20.28,52.99 19.54,53.73 18.98,53.73 DDR3_1.N9 | 19.77,56.33 19.15,56.39 | v22.03,55.88 22.03,56.22 21.58,56.67 DDR3_1.H9 | v20.9,59.16 20.9,58.59 DDR3_1.G7 | v24.52,57.69 24.35,57.86 23.9,57.86 DDR3_1.E9 | 25.54,61.31 v25.65,61.42 | v25.71,58.08 25.37,58.08 24.86,58.59 24.29,58.59 DDR3_1.D9 | v26.7,58.93 26.36,59.27 24.75,59.27 DDR3_1.C9 | 17.79,60.01 17.62,60.18 DDR3_1.H2 | v18.35,59.44 18.02,59.78 | v21.13,62.33 20.84,62.61 | 20.45,63.01 20.62,62.84 | C34.1 29.23,46.46 | 21.58,64.14 21.75,63.97 | 22.2,63.52 21.98,63.74 | DDR3_1.E9 | DDR3_1.G7 | DDR3_1.N9 | 19.77,56.33 | 19.77,56.33 DDR3_1.K8
  Top 0.203: v15.19,60.91 15.41,60.69 15.98,60.69 16.04,60.63 | 32.67,42.86 v32.69,42.84 32.67,42.86 | v32.65,46.37 32.57,46.46 U$1.053 29.23,46.46 C34.1 | v33.94,50.19 33.76,50.37 U$1.043 33.76,52.75 33.26,53.25 C33.1 | 41.76,54.23 U$1.023 | U$1.023 | C32.1 38.96,55.38 U$1.030 38.96,50.69 39.1,50.55 | C36.1 29.43,42.86 U$1.062 32.67,42.86 | U$1.023 v41.76,50.19
  Top 0.229: 18.92,51.86 v18.92,51.75 | v13.6,58.65 14.05,58.65 DDR3_1.N1 | v18.69,57.07 18.69,56.84 18.86,56.67 | v17.73,63.23 17.73,62.89 DDR3_1.F1 | 22.2,63.52 v22.31,63.52 | DDR3_1.A1 21.52,65.78 v21.52,65.89 | 20.45,63.01 DDR3_1.D2 DDR3_1.C1 | 16.49,60.18 16.43,60.23 | DDR3_1.A8 25.54,61.31 | C86.1 13.4,63.84 v13.4,62.65 | DDR3_1.B2 | DDR3_1.B2 21.58,64.14 | DDR3_1.R1 13.07,57.33 12.48,57.33 12.4,57.41 v12.36,57.41 | DDR3_1.N1 | 16.49,60.18 | 16.49,60.18 DDR3_1.K2
  Route15 1.016: 19.2,47.65 v9.8,38.25 8.02,38.25
  Bottom 0.152: 15.31,48.74 C3.1 16.91,49.73 v18.92,51.75 | 15.31,48.74 | 15.31,48.74 R3.2 | SB10.R2 8.46,36.7 SB10.R1 | R10.2 39.63,50.7 v39.33,50.39
  Bottom 0.203: C28.1 16.08,60.02 v15.19,60.91 | C7.1 39.63,52.73 R10.2
  Bottom 0.229: C26.1 20.96,51.97 v20.28,52.65 | C25.1 18.92,51.85 v18.92,51.75 | C27.1 24.52,57.58 v24.52,57.69 | C24.1 25.71,58.61 v25.71,58.08 | C30.1 21.52,65.74 v21.52,65.89 | C31.1 12.4,57.41 v12.36,57.41 | v17.73,63.23 18.79,62.17 C29.1 | C29.1
  Bottom 1.016: R26.1 6.8,36.94 6.8,37.85 7.2,38.25 v8,38.25 8.8,38.25 | 8.8,38.25 8.78,38.23 SB10.R1 | v9.8,38.25 v8.9,38.25 8.8,38.25
  pour Route15 (isolate 0.254, no thermals): 8,71.95 42,71.95 42,49.45 35.8,49.45 33.46,49.49 33.23,41.54 8,42.95
3.3V  (via drill 0.3)
  Top 0.152: SB8.R1 11.12,27.62 SB8.R2 | v12.4,29.35 12.8,28.95 v13.2,28.55 | U$7.019 | U$7.029 40.75,26.4 | 40.75,26.4 v40.72,26.43 40.4,26.43 | 40.8,26.35 40.75,26.4 | U$7.028 41.25,26.32 41.28,26.35 | U$7.032 39.25,26.08 39.6,26.43 40.4,26.43 | U$7.030 40.25,26.28 40.4,26.43 | LLNK.A 54.64,28.64 v54.64,30.03 | R34.2 12.74,41.2 | 12.74,41.2 14.03,41.2 U$17.3 15.18,41.33 v15.5,41.65 | 12.74,41.2 12.7,41.24 | SB4.L1 36.65,18.04 36.9,17.79 v37.2,17.79 | R17.2 10.1,30.65 v11.5,29.25 | R40.2 13.34,35.17 v13.84,34.67
  Top 0.203: U$1.142 54.27,36.06 v54.32,36.11 | U$1.076 34.31,37.26 35.4,38.35 35.4,38.95 35,39.35 34.9,39.35 33.5,40.75 | U$1.163 53.89,44.46 v54.2,44.15 | U$1.005 48.96,52.99 v48.9,53.05 | U$1.100 37.76,29.41 v37.3,28.95 36.9,28.95 36.56,29.29 U$1.097 | v32.6,49.95 33.5,49.05 v33.5,46.35 33.5,40.75 | 33.5,40.75 v33.1,40.75
  Top 0.229: U$7.019 v45.76,26.59 | U$7.027 41.75,26.12 41.52,26.35 41.28,26.35 40.8,26.35 | U$7.033 36.99,24.4 v36.96,24.43 | U$7.039 37.03,21.4 v36.96,21.47 | U$7.040 37.19,20.9 v36.96,20.67 | U$7.046 37.31,17.9 v37.2,17.79
  Top 0.61: L1.2 34.79,14.59 v33.68,14.59 | SB8.R1 11.45,29.2 v11.5,29.25 | 11.8,27.95 12.7,27.95 v12.9,27.75
  Top 1.016: R29.1 11.8,26.9 11.8,27.95 12.8,28.95 v13.1,29.25
  Route15 1.016: 5.67,24.62 10.3,29.25 v11.5,29.25 v13.1,29.25 13.1,25.55 14.4,24.25 14.4,22.55 17.9,19.05 v18.74,19.05 v19.44,19.05 | 5.67,24.62 3,21.95 3,13.95 v2.5,13.45 v2,12.95 | 5.67,24.62 1.31,28.99 v1.28,28.99 v1.28,29.71
  Bottom 0.152: SB7.L1 55.28,26.98 55.28,29.39 v54.64,30.03 | v19.44,19.05 20.46,19.05 21.31,19.9 U$11.1 | R42.2 32.89,13.8 v33.68,14.59 | IC1.6 44.72,28.27 v44.72,27.39 | U$12.1 3.21,32.52 2.8,32.11 2.8,31.94 U$12.4 | D4.A 53.9,37.45 v54.1,37.25 | R37.2 31.85,51.49 | 32.6,51.49 32.6,51.48 | RA13.8 35.05,46.15 33.7,46.15 v33.5,46.35
  Bottom 0.203: RA14.8 RA14.7 RA14.6 RA14.5 34.65,23.8 v34.96,24.11 | v54.32,36.11 52.62,36.11 C70.1 | C73.1 v54.2,44.15 | C71.1 48.9,52.08 v48.9,53.05 | C72.1 37.5,29.15 v37.3,28.95 | v38.62,46.51 38.53,46.6 RA13.5 RA13.6 RA13.7 RA13.8 | 31.85,51.49 32.6,51.49 R38.2 | 32.6,51.48 v32.6,49.95
  Bottom 0.229: C17.1 36.96,20.64 v36.96,20.67 | C16.1 36.96,24.22 v36.96,24.43 | C15.1 40.72,26.22 v40.72,26.43 | C14.1 45.67,26.59 v45.76,26.59 | v37.2,17.79 37.69,18.28 C18.1 | C51.1 54.48,34.63 v54.5,34.65
  Bottom 0.305: U$13.1 4.3,19.65 v3.5,20.45 | L9.1 40.56,56.39 41.2,55.75 43.9,55.75 v44,55.85
  Bottom 0.61: U$13.4 2.65,16.55 C56.1 2.65,13.6 v2.5,13.45 v2,12.95 | D6.A 12.9,29.25 v13.1,29.25 | v18.74,19.05 19.12,19.05 | 19.12,19.05 v19.44,19.05 | 19.12,19.05 19.12,18.19 19.31,18 U$11.4 19.7,16.44 C52.1
  Bottom 1.016: U$12.4 1.28,30.42 v1.28,29.71 v1.28,28.99 1.28,27.56 C54.1
  pour Route15 (isolate 0.254, rank 5, no thermals): -5,74.95 60,74.95 60,-5.05 -5,-5.05
3.3V_FB
  Top 0.152: C49.2 15.35,27.25 R18.1 R19.2 15.65,24.15 17.8,24.15 18.2,23.75 18.2,19.35 18,19.15 14.95,19.15 U$10.2
3.3V_U
  Top 0.152: SB8.L1 9.88,28.27 SB8.L2 | 9.65,25.63 13.33,25.63 R18.2 13.65,27.25 C49.1
  Top 0.61: 9.2,27.95 SB8.L1 | C50.1 9.65,24.6 9.65,25.63 R29.2
  Top 1.016: L3.P$2 4.9,27.95 9.2,27.95 9.2,26.9 R29.2
3V3_EN
  Top 0.229: U$10.1 14.92,16.78 15.21,16.49 | 15.21,16.49 R48.2 | 15.21,16.49 15.04,16.49 14,15.45 CONN13.P 12.2,14.65 Q1.3
12V  (via drill 0.3)
  Top 0.203: CONN6.P 5.42,12.02 5.33,12.02
  Top 0.229: Q1.2 7.2,13.7 R47.2 5.33,12.02 5.1,11.8 4.95,11.8 | R45.2 4.45,16.3 4.5,16.35
  Top 0.61: U$16.B2 4,9.95 | 4,9.95 4,11.25 4.2,11.45 4.2,11.35 | U$16.B3 5,11.15 | U$16.B1 3,10.15 4.2,11.35 | 8.1,17.35 8.6,17.84 U$10.8 | C45.1 6,16.85 | 5,11.15 4.5,11.65 4.2,11.35 | 5,11.15 5,11.75 4.95,11.8 4.6,12.15 | v4.5,8.55 4.5,9.45 4,9.95 | v4.5,10.65 4.5,11.55
  Top 1.016: 4.5,16.85 4.5,16.35 4.5,11.65 4.5,11.55 4.1,11.15 | 4.5,16.85 C43.1 C44.1 | 4.5,16.85 6,16.85 7.6,16.85 8.1,17.35
  Bottom 0.61: U$16.B2 4,8.05 v4.5,8.55 | U$16.B3 5,10.15 v4.5,10.65
AVCC  (via drill 0.3)
  Top 0.203: U$1.081 29.69,35.26 29.2,35.75 CONN7.P
  Route15 0.61: v17.6,26.75 26.8,26.75 28.7,28.65 28.7,36.51 CONN7.P
  Bottom 0.152: SB11.R1 16.32,28.68 SB11.R2
  Bottom 0.61: SB11.R1 16.6,28.3 16.6,26.75 R30.2 16.6,26.8 17.65,26.8 | 17.65,26.8 C68.1 | 17.65,26.8 v17.6,26.75
AVCC_U
  Bottom 0.152: SB11.L1 15.07,28.02 SB11.L2
  Bottom 0.61: L8.2 R30.1 14.75,26.85 SB11.L1
DDR3_A0
  Top 0.14: 13.43,53.59 15.88,56.03
  Top 0.152: RA10.8 18.86,46.49 17.45,47.9 16.77,47.9 13.43,51.24 13.43,53.59 | 15.88,56.03 15.88,56.71 15.36,57.23 DDR3_1.N3 | DDR3_1.N3
DDR3_A1
  Top 0.127: 17.45,52.43 17.22,52.65 17.22,52.99 17.45,53.22 17.45,53.56 17.22,53.79
  Top 0.152: 17.22,53.79 17.05,53.95 DDR3_1.P7 | 17.45,52.43 17.56,52.31 18.02,52.31 18.35,51.98 18.35,51.52 20.42,49.46 RA8.6 | RA8.6
DDR3_A2
  Top 0.14: 12.75,53.76 15.13,56.13
  Top 0.152: RA11.6 22.78,40.46 22.3,40.94 19.18,40.94 18.06,42.06 | 12.75,53.76 12.75,51.01 18.06,45.71 18.06,42.06 | 15.13,56.13 15.13,56.44 | DDR3_1.P3 15.13,56.44 | 15.13,56.44 | 18.06,42.06
DDR3_A3
  Top 0.14: 13.09,53.67 15.52,56.1 | 14.96,57.18 15.19,56.95
  Top 0.152: RA11.5 19.34,41.26 18.38,42.22 18.38,45.84 13.09,51.13 13.09,53.67 | 15.52,56.1 15.52,56.62 15.19,56.95 | 14.96,57.18 14.79,57.35 DDR3_1.N2 | DDR3_1.N2
DDR3_A4
  Top 0.127: 17.79,53.56 17.79,53.22 18.02,52.99 18.24,52.99 18.41,52.82
  Top 0.152: 20.41,50.26 19.49,51.18 19.49,51.98 19.15,52.31 18.92,52.31 18.41,52.82 | 17.79,53.79 17.79,53.56 | 17.79,53.79 | 17.79,53.79 DDR3_1.P8 | 20.41,50.26 | 20.41,50.26 RA8.5
DDR3_A5
  Top 0.14: 12.41,53.84 14.62,56.05 | 14.62,56.39 14.39,56.61
  Top 0.152: 23.1,39.66 22.14,40.62 19.02,40.62 17.74,41.9 17.74,45.57 12.41,50.9 12.41,53.84 | 14.39,56.61 14.22,56.78 DDR3_1.P2 | 14.62,56.39 14.67,56.34 14.67,56.1 14.62,56.05 | DDR3_1.P2 | 23.1,39.66 | 23.1,39.66 RA11.7
DDR3_A6
  Top 0.127: 16.88,52.99 16.88,52.65 16.66,52.43 16.66,52.09 16.88,51.86
  Top 0.152: 21.62,48.66 21.56,48.71 | 21.56,48.71 21.19,49.09 20.33,49.09 18.47,50.96 17.79,50.96 16.88,51.86 | DDR3_1.R8 16.88,53.22 16.88,52.99 | RA8.7 21.95,48.71 21.56,48.71
DDR3_A7
  Top 0.14: 12.7,56.39 12.92,56.61
  Top 0.152: RA12.7 18.44,38.16 16.46,40.14 16.46,45.04 11,50.5 11,54.69 12.7,56.39 | 12.92,56.61 13.09,56.78 DDR3_1.R2 | DDR3_1.R2
DDR3_A8
  Top 0.152: 21.38,47.86 20.49,48.75 20.22,48.75 18.35,50.62 17.68,50.62 16.26,52.03 16.26,52.6 DDR3_1.T8 | 21.38,47.86 | 21.38,47.86 RA8.8
DDR3_A9
  Top 0.14: 13.49,56.05 13.26,55.82
  Top 0.152: 13.49,56.05 13.66,56.22 DDR3_1.R3 | 13.26,55.82 11.74,54.29 11.74,50.67 17.1,45.31 17.1,41.58 18.92,39.76 RA12.5 | DDR3_1.R3 | RA12.5
DDR3_A10
  Top 0.127: 20.28,55.26 20.05,55.48 | 19.71,55.82 19.49,56.05
  Top 0.152: RA7.6 26.4,49.96 25.98,50.38 25.98,50.94 25.5,51.42 22.75,51.42 21.8,52.37 21.8,53.95 20.56,55.2 20.33,55.2 20.28,55.26 | 19.49,56.05 18.86,56.1 DDR3_1.L7 | 20.05,55.48 19.71,55.82 | DDR3_1.L7
DDR3_A11
  Top 0.127: 16.09,52.99 16.32,53.22
  Top 0.152: RA9.5 22.03,47.34 21.34,47.34 21.18,47.34 18.24,50.28 17.56,50.28 15.81,52.03 15.81,52.71 16.09,52.99 | 16.49,53.39 16.32,53.22 | DDR3_1.R7 16.49,53.39 | 16.49,53.39
DDR3_A12
  Top 0.127: 17.79,54.35 18.02,54.12 | 18.58,53.56 18.35,53.79
  Top 0.152: RA7.8 26.4,48.36 25.34,49.42 25.34,50.62 25.18,50.78 21.25,50.78 19.71,52.31 19.71,53.11 19.4,53.42 18.72,53.42 18.58,53.56 | 17.62,54.52 17.79,54.35 | 18.02,54.12 18.35,53.79 | DDR3_1.N7 17.62,54.52 | 17.62,54.52
DDR3_A13
  Top 0.152: 17.42,44.39 17.42,45.44 12.07,50.79 12.07,54.07 DDR3_1.T3 | 17.42,44.39 | 17.42,44.39 17.42,41.74 18.86,40.3 21.66,40.3 23.1,38.86 RA11.8 | RA11.8
DDR3_A14
  Top 0.152: RA9.6 23.24,44.96 22.7,45.5 22.7,46.14 | 22.7,46.14 21.82,47.02 21.18,47.02 | 21.18,47.02 21.05,47.02 18.13,49.94 17.45,49.94 15.47,51.92 15.47,52.94 DDR3_1.T7 | 22.7,46.14 | 21.18,47.02
DDR3_BA0
  Top 0.14: 13.77,53.5 16.44,56.17 | 15.53,57.75 15.77,57.5
  Top 0.152: RA10.7 19.66,46.14 17.56,48.24 16.88,48.24 13.77,51.35 13.77,53.5 | 16.44,56.17 16.44,56.61 15.77,57.28 15.77,57.5 | 15.53,57.75 15.36,57.91 DDR3_1.M2 | DDR3_1.M2
DDR3_BA1
  Top 0.127: 18.92,54.35 19.15,54.12
  Top 0.152: RA7.7 26.24,49.16 25.66,49.74 25.66,50.78 25.34,51.1 22.63,51.1 19.68,54.04 19.23,54.04 19.15,54.12 | 18.75,54.52 18.92,54.35 | DDR3_1.N8 18.75,54.52 | 18.75,54.52
DDR3_BA2
  Top 0.14: 14.11,53.42 16.76,56.07
  Top 0.152: RA10.6 20.46,45.82 20.44,45.82 17.68,48.58 17,48.58 14.11,51.47 14.11,53.42 | 16.76,56.07 16.76,56.73 16.08,57.42 16.08,57.65 15.92,57.8 | 15.92,57.8 | 15.92,57.8 DDR3_1.M3
DDR3_CAS
  Top 0.14: 14.79,53.25 17.45,55.91
  Top 0.152: RA9.8 23,43.36 22.06,44.3 22.06,45.82 21.5,46.38 | 14.79,53.25 14.79,51.69 17.22,49.26 17.9,49.26 20.78,46.38 21.5,46.38 | 17.45,55.91 17.45,58.65 | DDR3_1.K3 17.45,58.65 | 17.45,58.65 | 21.5,46.38
DDR3_CK
  Top 0.127: 21.41,56.39 21.18,56.61 | 20.62,57.18 20.84,56.95
  Top 0.152: R5.2 23.81,54.06 R9.1 | 20.45,57.35 20.62,57.18 | R9.1 23.39,54.41 | 20.84,56.95 21.18,56.61 | 21.41,56.39 21.47,56.33 21.47,55.65 22.17,54.95 22.6,54.95 22.8,55.15 23.2,55.15 23.46,54.89 R9.1 | DDR3_1.J7 20.45,57.35 | 20.45,57.35
DDR3_CK#
  Top 0.127: 20.62,56.05 20.84,55.82 | 20.28,56.39 20.05,56.61
  Top 0.152: R6.2 23.61,52.56 R9.2 23.4,52.77 23.11,52.77 | 23.17,52.71 23.11,52.77 | 23.11,52.77 22.54,53.34 22.54,54.12 20.84,55.82 | 20.05,56.61 19.43,56.67 DDR3_1.K7 | 20.62,56.05 20.28,56.39 | DDR3_1.K7
DDR3_CKE
  Top 0.152: 26.77,50.95 25.98,51.74 | 20.56,55.65 22.14,54.07 22.14,52.51 22.91,51.74 25.98,51.74 | DDR3_1.K9 20.56,55.65 | 20.56,55.65 | 26.77,50.95 | 26.77,50.95 RA7.5 | 25.98,51.74
DDR3_DML
  Top 0.152: RA3.6 30.26,64.16 30.52,63.91 30.52,62.44 29.84,61.76 27.91,61.76 26.22,63.46 24.41,63.46 22.14,61.2 DDR3_1.E7
DDR3_DMU
  Top 0.152: RA3.5 24.55,64.96 21.3,61.7 20.84,61.7 20.45,62.1 DDR3_1.D3 | DDR3_1.D3
DDR3_DQ0
  Top 0.14: 18.92,63.4 19.15,63.18 | 19.49,62.84 19.71,62.61
  Top 0.152: 33.26,67.08 37.74,67.08 39.48,65.34 RA1.8 | DDR3_1.E3 19.88,62.44 19.71,62.61 | 18.92,63.4 18.64,63.68 18.64,64.93 20.55,66.84 33.02,66.84 33.26,67.08 | 19.49,62.84 19.15,63.18 | 33.26,67.08
DDR3_DQ1
  Top 0.127: 21.98,58.88 22.31,58.88 22.54,58.65 22.88,58.65 23.11,58.88 23.45,58.88 23.67,58.65
  Top 0.152: 23.67,58.65 24.05,58.27 24.73,58.27 25.11,57.89 arc-45 25.12,57.87 25.12,56.99 25.28,56.83 27.6,56.83 arc-90 27.76,56.67 arc-90 27.6,56.51 24.88,56.51 arc90 24.72,56.35 arc90 24.88,56.19 27.84,56.19 28.64,56.99 28.64,57.71 29.12,58.19 RA5.7 29.42,58.16 | 21.98,58.88 21.75,58.88 DDR3_1.F7
DDR3_DQ2
  Top 0.14: 18.35,62.84 18.58,62.61
  Top 0.152: RA1.7 40.28,65.26 38.14,67.4 33.02,67.4 32.78,67.16 20.42,67.16 18.3,65.04 18.3,62.89 18.35,62.84 | 18.75,62.44 18.58,62.61 | 18.75,62.44 | 18.75,62.44 DDR3_1.F2
DDR3_DQ3
  Top 0.127: 22.54,58.31 22.88,58.31 23.11,58.08
  Top 0.152: 23.11,58.08 23.83,57.36 24.06,57.36 24.22,57.2 arc45 24.33,57.15 24.64,57.15 arc-90 24.8,56.99 arc-90 24.64,56.83 24.56,56.83 arc90 24.4,56.67 24.4,56.11 24.64,55.87 28,55.87 28.48,56.35 31.36,56.35 arc90 31.52,56.51 arc90 31.36,56.67 30.8,56.67 30.56,56.91 30.56,59.79 30.48,59.87 30.32,59.87 30.24,59.79 30.24,56.91 30,56.67 29.12,56.67 arc-90 28.96,56.83 28.96,57.07 arc-90 29.25,57.36 29.42,57.36 RA5.8 | 22.54,58.31 22.31,58.31 DDR3_1.F8 | DDR3_1.F8
DDR3_DQ4
  Top 0.127: 17.17,61.76 17.45,61.48 | 18.02,60.91 17.79,61.14
  Top 0.152: RA1.5 41.88,65.26 39.1,68.04 32.54,68.04 32.3,67.8 20.16,67.8 16.04,63.68 16.04,62.78 17.05,61.76 17.17,61.76 | 18.18,60.74 18.02,60.91 | 17.79,61.14 17.45,61.48 | DDR3_1.H3 18.18,60.74 | 18.18,60.74
DDR3_DQ5
  Top 0.127: 21.75,57.18 21.98,56.95
  Top 0.152: 21.58,57.35 21.75,57.18 | 21.98,56.95 22.03,56.9 22.03,56.67 23.22,55.48 23.9,55.48 24.52,54.86 27.46,54.86 28.37,53.95 R7.2 | DDR3_1.H8 21.58,57.35 | 21.58,57.35
DDR3_DQ6
  Top 0.14: 17.79,62.27 18.02,62.04
  Top 0.152: RA1.6 41.08,65.18 38.54,67.72 32.78,67.72 32.54,67.48 20.29,67.48 17.17,64.36 17.17,62.89 17.79,62.27 | 18.18,61.87 18.02,62.04 | DDR3_1.G2 18.18,61.87 | 18.18,61.87
DDR3_DQ7
  Top 0.127: 21.18,58.08 21.41,58.31 21.75,58.31 21.98,58.08 | 22.31,57.75 22.54,57.52
  Top 0.152: 21.18,58.08 21.01,57.91 DDR3_1.H7 | 22.54,57.52 22.6,57.46 22.82,57.46 23.28,57.01 23.28,56.56 24.32,55.52 R8.2 | 21.98,58.08 22.31,57.75 | DDR3_1.H7 | R8.2
DDR3_DQ8
  Top 0.127: 23.39,60.29 24.92,61.82
  Top 0.152: 24.92,61.82 25.09,61.99 25.88,61.99 27.52,60.35 32.16,60.35 32.24,60.27 32.24,59.79 32.32,59.71 32.48,59.71 32.56,59.79 32.56,60.51 32.64,60.59 32.8,60.59 32.88,60.51 32.88,59.63 32.96,59.55 33.12,59.55 33.2,59.63 33.2,60.59 33.28,60.67 33.44,60.67 33.75,60.36 33.75,60.02 RA4.8 | 23.39,60.29 23.15,60.29 22.87,60.57 22.87,61.08 arc90 22.71,61.24 arc90 22.55,61.08 22.55,60.34 arc90 DDR3_1.D7
DDR3_DQ9
  Top 0.14: 20.84,63.74 20.61,63.97 20.61,64.3 20.84,64.53 | 21.18,64.87 21.47,65.16
  Top 0.152: RA2.6 33.12,65.78 32.7,66.2 22.63,66.2 21.58,65.16 21.47,65.16 | 21.01,63.57 20.84,63.74 | 21.18,64.87 20.84,64.53 | 21.01,63.57 | 21.01,63.57 DDR3_1.C3
DDR3_DQ10
  Top 0.127: 24.01,59.44 24.24,59.22
  Top 0.152: 24.01,59.44 23.84,59.61 DDR3_1.C8 | 24.24,59.22 24.5,58.96 24.95,58.96 25.26,58.65 25.95,58.65 arc-45 26.07,58.6 26.32,58.35 26.32,57.87 26,57.55 25.6,57.55 arc90 25.44,57.39 arc90 25.6,57.23 26.48,57.23 arc90 26.64,57.39 26.64,58.19 arc-90 26.8,58.35 arc-90 26.96,58.19 26.96,57.39 arc90 27.12,57.23 arc90 27.28,57.39 27.28,58.83 arc-90 27.44,58.99 arc-90 27.6,58.83 27.6,57.39 arc90 27.76,57.23 arc90 27.92,57.39 27.92,58.83 28,58.91 28.16,58.91 28.24,58.83 28.24,58.11 28.32,58.03 28.48,58.03 28.56,58.11 28.56,58.83 28.69,58.96 29.42,58.96 RA5.6 | DDR3_1.C8
DDR3_DQ11
  Top 0.14: 20.05,64.53 20.29,64.3 20.29,63.96
  Top 0.152: 33.4,66.58 33.34,66.52 20.68,66.52 19.71,65.55 19.71,64.87 20.05,64.53 | 33.4,66.58 | 20.29,63.96 20.29,63.73 DDR3_1.C2 | 33.4,66.58 RA2.5 | RA2.5 | DDR3_1.C2
DDR3_DQ12
  Top 0.152: DDR3_1.A7 24.86,62.33 25.99,62.33 27.42,60.89 27.57,60.75 32.24,60.75 32.48,60.99 34,60.99 34.08,61.07 34.08,61.23 34,61.31 32.72,61.31 32.64,61.39 32.64,61.55 32.72,61.63 34.24,61.63 34.4,61.47 34.4,60.67 34.56,60.51 RA4.7
DDR3_DQ13
  Top 0.152: DDR3_1.A2 22.76,65.88 32.54,65.88 33.44,64.98 RA2.7 | RA2.7
DDR3_DQ14
  Top 0.127: 24.58,60.01 24.8,59.78
  Top 0.152: 24.58,60.01 24.41,60.18 DDR3_1.B8 | 24.8,59.78 24.97,59.61 26.48,59.61 arc45 26.59,59.66 26.88,59.95 26.96,59.95 arc-90 27.12,59.79 27.12,59.47 arc90 27.28,59.31 arc90 27.44,59.47 27.44,59.79 arc-90 27.6,59.95 arc-90 27.76,59.79 27.76,59.47 arc90 27.92,59.31 arc90 28.08,59.47 28.08,59.79 arc-90 28.24,59.95 arc-90 28.4,59.79 28.4,59.47 arc90 28.56,59.31 arc90 28.72,59.47 28.72,59.6 arc-90 28.88,59.76 29.42,59.76 RA5.5 | DDR3_1.B8
DDR3_DQ15
  Top 0.152: RA2.8 33.76,64.18 32.38,65.56 28.54,65.56 | 28.54,65.56 23.57,65.56 DDR3_1.A3 | 28.54,65.56
DDR3_DQSL
  Top 0.152: 27.22,63.36 26.27,64.31 24.35,64.31 20.79,60.74 19.88,60.74 DDR3_1.F3 | 27.22,63.36 | 27.22,63.36 RA3.7
DDR3_DQSL#
  Top 0.152: 27.56,62.56 26.27,63.85 24.35,63.85 20.67,60.18 19.32,60.18 DDR3_1.G3 | 27.56,62.56 | 27.56,62.56 RA3.8
DDR3_DQSU
  Top 0.152: DDR3_1.C7 23.28,61.87 24.41,63.01 26.22,63.01 27.65,61.58 27.83,61.39 31.92,61.39 32,61.47 32,61.63 31.92,61.71 30.64,61.71 30.56,61.79 30.56,61.95 30.64,62.03 32,62.03 32.24,62.27 35.44,62.27 36.16,61.55 36.16,60.84 RA4.5
DDR3_DQSU#
  Top 0.152: DDR3_1.B7 23.84,61.99 24.52,62.67 26.08,62.67 27.68,61.07 32.08,61.07 32.32,61.31 32.32,61.79 32.48,61.95 34.56,61.95 34.72,61.79 34.72,60.99 34.8,60.91 34.96,60.91 35.04,60.99 35.04,61.79 35.12,61.87 35.28,61.87 35.36,61.79 35.36,61.55 35.52,61.39 35.76,61.39 35.84,61.31 35.84,61.15 35.76,61.07 35.52,61.07 35.36,60.91 RA4.6
DDR3_ODT
  Top 0.152: RA12.8 18.6,37.36 16.14,39.82 16.14,44.91 10.66,50.39 10.66,56.57 14.44,60.35 15.75,60.35 | 15.75,60.35 | 15.75,60.35 DDR3_1.K1
DDR3_RAS
  Top 0.14: 15.13,53.16 17.8,55.83
  Top 0.152: RA9.7 23,44.16 22.38,44.78 22.38,45.98 21.66,46.7 20.92,46.7 18.02,49.6 17.34,49.6 15.13,51.8 15.13,53.16 | 17.8,55.83 17.8,59.44 DDR3_1.J3 | DDR3_1.J3
DDR3_RST
  Top 0.152: RA12.6 18.76,38.96 16.78,40.94 16.78,45.18 11.4,50.56 11.4,54.52 DDR3_1.T2
DDR3_VREF  (via drill 0.3)
  Top 0.127: 19.73,54.68 19.49,54.92
  Top 0.152: 19.73,54.68 20.29,54.68 v20.5,54.46 | 19.32,55.09 19.49,54.92 | DDR3_1.H1 16.15,62.21 v15.47,62.21 | DDR3_1.M8 19.32,55.09 | 19.32,55.09
  Bottom 0.152: 20.45,56.5 20.45,58.03 19.37,59.1 19.37,59.67 18.74,60.3 18.17,60.3 16.64,61.83 15.85,61.83 v15.47,62.21 | 20.45,56.5 19.24,56.5 C4.1 | C4.1 C3.2 15.38,50.37 R3.1 | 20.45,56.5 20.45,54.52 v20.5,54.46 | R4.2 13.96,51.64 C4.1
DDR3_WE
  Top 0.14: 14.45,53.33 17.13,56.01
  Top 0.152: RA10.5 21.26,45.82 21.02,46.06 20.65,46.06 17.79,48.92 17.11,48.92 14.45,51.58 14.45,53.33 | 17.13,56.01 17.13,58.18 16.83,58.48 | 16.83,58.48 | 16.83,58.48 DDR3_1.L3
ETH_RXN
  Top 0.152: C41.2 48.4,8.45 48,8.05 U$16.B44
ETH_RXP
  Top 0.152: C42.2 47.6,10.3 47.6,8.95 47,8.35 U$16.B43
ETH_TXN
  Top 0.152: C39.2 52,10.4 U$16.B48
ETH_TXP
  Top 0.152: C40.2 50.9,10.15 51.1,9.95 51.3,9.95 51.6,9.65 51.6,8.75 51,8.15 U$16.B47
GND  (via drill 0.3, 0.51)
  Top 0.127: 16.6,61.2 17,60.8 | 22.31,59.22 21.98,59.22 21.75,59.44 | 19.43,57.23 19.71,56.95
  Top 0.14: 16.09,58.31 16.32,58.08 | 19.49,61.7 19.71,61.48
  Top 0.152: C64.2 35.62,55.46 | C36.2 27.81,42.54 | v19.15,52.88 18.81,52.88 18.35,53.33 18.24,53.33 DDR3_1.P9 | 20.33,56.9 19.71,56.95 | 22.82,57.91 23.84,56.9 v23.84,56.78 | 26.22,60.74 v26.27,60.8 | v21.52,60.12 21.52,59.67 21.75,59.44 | 15.92,58.48 16.09,58.31 | v16.59,57.82 16.32,58.08 | 19.32,61.87 19.49,61.7 | 19.94,61.25 19.71,61.48 | 22.54,59.22 22.31,59.22 | v20.79,53.73 20.73,53.79 20.39,53.79 19.82,54.35 19.49,54.35 DDR3_1.M9 | R19.1 C50.2 | C48.2 v17.2,17.15 | C47.2 17.05,22.95 v15.6,22.95 | 22.82,57.91 | 22.82,57.91 DDR3_1.F9 | DDR3_1.M9 | 47.3,14.45 49.6,14.45 50.5,15.35 50.5,22.85 51.5,23.85 51.5,24.05 51.6,23.95 53.5,23.95 54.7,22.75 54.7,15.35 53.7,14.35 v52.8,14.35 51.92,13.47 46,13.47 | U$7.P$8 40.75,23.9 U$7.034 | C87.2 15.52,37.87 v15.9,38.25 15.11,39.04 U$17.2 | 33.6,26.51 32.4,25.31 32.4,17.31 33.04,16.67 | v33.77,15.71 34.4,16.34 34.4,16.67 33.04,18.03 33.04,24.83 34.88,26.67 | L3V3.C 2.23,31.14 2.64,31.55 v5.36,31.55 | LIND.C 5.7,49.95 CONN5.P | SW_UBOOT.1 3.51,39.5 v4.24,38.77 | S_RESET.1 4.25,45.3 v4.3,45.25 | 22.54,59.22 | 22.54,59.22 DDR3_1.E8
  Top 0.203: 35.62,55.46 v35.02,56.06 | v37.58,57.5 37.58,56.76 C32.2 | v41.66,56.46 41.7,56.42 C35.2 | 27.81,42.54 v27.1,42.54 | C34.2 27.08,46.72 v26.86,46.94 | C35.2 | L11.C L10.C 46.55,68.3 v46.6,68.35 | 29.11,28.31 28,27.2 28,26.45 26.8,25.25 25,25.25 23.8,26.45 23.8,34.95 24.8,35.95 26.7,35.95 27.8,34.85 27.8,34.4 C1.1 29.85,33 30,32.85 30,31.75 30.6,31.15 32.7,31.15 33,31.45 34.9,31.45 | 29.11,28.31 C2.1 | 29.11,28.31 31.27,28.31 | 31.27,28.31 32.04,28.31 32.6,27.75 33.2,27.75 33.6,27.35 33.6,26.51 | 31.27,28.31 31.27,28.32 v31.3,28.35 | SB3.L2 34.98,20.09 SB3.L1 34.8,20.31 SB1.L1 | SB1.L1 35,22.71 SB1.L2 | R13.1 38.35,11.23 | SB1.L1 34.8,23.15 35.12,23.47 36.64,23.47 v36.88,23.23 36.88,23.31 37.47,23.9 U$7.034 | U$1.079 33.29,36.06 v33.4,35.95 | CONN8.P$1 8.5,68.85 v8.6,68.95 | C33.2 31.98,54.17 31.6,53.79 v31.6,53.15
  Top 0.229: v17.79,51.75 17.56,51.75 DDR3_1.T9 | DDR3_1.T1 12.13,56.39 v11.79,56.39 | v12.98,58.03 13.55,58.03 DDR3_1.P1 | v14.62,59.67 14.62,59.22 DDR3_1.M1 | v15.98,61.25 16.09,61.37 16.43,61.37 16.6,61.2 | v19.26,57.63 19.26,57.41 19.43,57.23 | DDR3_1.B3 21.75,63.4 v21.75,62.95 | 19.94,61.25 20.39,61.25 v20.45,61.31 | DDR3_1.E1 DDR3_1.E2 | 19.32,64.14 19.3,64.15 | 19.3,64.15 v19.2,64.25 | 17.05,60.74 17,60.8 | DDR3_1.G8 DDR3_1.G9 v22.71,56.78 | DDR3_1.E8 DDR3_1.D8 | v20.33,65.38 20.45,65.27 DDR3_1.B1 | C86.2 11.8,63.88 v11.8,62.65 | U$16.B4 v6,9.95 | U$16.B7 v9,9.95 | U$16.B13 17,8.77 v17.46,9.23 | U$16.B17 v21,9.35 | U$16.B21 v25,9.35 | U$16.B25 v29,9.35 | U$16.B29 v33,9.35 | U$16.B33 v37,9.35 | U$16.B37 v41,9.35 | U$16.B41 v45,9.35 | U$16.B45 v49,9.35 | U$16.B14 18,8.35 v19,9.35 | U$16.B18 22,8.35 v23,9.35 | U$16.B22 26,8.35 v27,9.35 | U$16.B26 30,8.35 v31,9.35 | U$16.B30 34,8.35 v35,9.35 | U$16.B34 38,8.35 v39,9.35 | U$16.B38 42,8.35 v43,9.35 | U$16.B42 46,8.35 v47,9.35 | U$16.B46 50,8.35 v51,9.35 | L12V.C 1.6,17.75 v1.1,18.25 | DDR3_1.B9 | DDR3_1.B9 v25.88,60.18 | DDR3_1.A9 26.22,60.74 v26.27,60.8 | DDR3_1.J8 | DDR3_1.J8 20.33,56.9 | DDR3_1.G1 16.6,62.89 v16.6,63.01 | DDR3_1.D1 19.3,63.59 19.3,64.15 | DDR3_1.B1 | DDR3_1.E2 | DDR3_1.E2 19.32,61.87 | DDR3_1.P1 | DDR3_1.L2 | DDR3_1.L2 15.92,58.48 | DDR3_1.M1 | 17.05,60.74 | 17.05,60.74 DDR3_1.J2 | v22.71,56.78 | 38.35,11.23 37.68,11.23 v37.28,11.63 | R44.1 14.82,12.85 v14.96,12.99
  Top 0.61: C45.2 6,20.45 v5.8,20.65 | C50.2 11.52,24.43 v11.52,23.07
  Bottom 0.152: v16.59,57.82 15.83,57.06 15.83,56.97 R2.1 | R4.1 12.55,51.64 C4.2 11.1,54.93 11.1,55.64 11.79,56.33 v11.79,56.39 | C37.1 53.45,23.45 51.3,23.45 50.6,22.75 50.6,14.35 51.6,13.35 53.15,13.35 | 53.15,13.35 C38.1 | 53.15,13.35 53.15,14 v52.8,14.35 | R21.1 23.09,21.39 v23.6,21.39 | L0.C 5.6,49.85 CONN5.P | R23.1 4.2,35.13 v4.2,36.05 | R11.1 45,52.76 44.41,53.35 | 44.41,53.35 C8.2 | 44.41,53.35 44.41,54.25 v44,54.65 43.79,54.86 R36.1 | R1.2 40.7,49.05 v40.1,49.65
  Bottom 0.203: C63.2 30.13,38.58 v29.8,38.25 | C82.1 31.3,31.85 v30.9,31.85 | C80.1 35.85,34.92 C81.1 v37.19,34.74 v37.2,34.75 37.95,35.5 C84.2 | C83.2 R41.1 v43,35.65 | C67.2 34.25,32.4 v34.5,32.15 | C66.2 40.3,32.45 40,32.15 v39.5,32.15 39.5,30.35 39.9,29.95 40.5,29.95 41,29.45 IC1.2 | C70.2 50.45,36 v49.3,37.15 | C73.2 49.8,44.15 v49.3,44.65 | C75.2 54.16,45.21 v54.2,45.25 | C74.2 54.18,46.87 v54.2,46.85 | C57.2 48.11,46.56 v48.1,46.55 | C62.2 51.33,50.08 v52,50.75 | C65.2 48.64,36.51 v49.3,35.85 | C61.2 46.95,52.3 v47.7,53.05 | C53.2 54.22,41.73 v54.3,41.65 | C55.2 43.84,46.89 v43.8,46.85 | C76.2 45.72,46.57 v45.5,46.35 | C71.2 51.6,51.55 v51.7,51.65 | C72.2 37.5,31.85 v37.8,32.15 | C28.2 16.68,60.55 v15.98,61.25 | CONN8.P$1 8.5,68.85 v8.6,68.95
  Bottom 0.229: C26.2 21,53.73 v20.79,53.73 | C25.2 19.15,53.46 v19.15,52.88 | C27.2 23.84,56.42 v23.84,56.78 | C24.2 24.34,60.18 v25.88,60.18 | C30.2 20.33,65.09 v20.33,65.38 | C31.2 11.79,56.17 v11.79,56.39 | v19.2,64.25 19.81,63.65 C29.2 | U$16.A15 v19,9.35 | U$16.A19 v23,9.35 | U$16.A23 v27,9.35 | U$16.A27 v31,9.35 | U$16.A31 v35,9.35 | U$16.A35 v39,9.35 | U$16.A39 v43,9.35 | U$16.A43 v47,9.35 | U$16.A47 v51,9.35 | U$16.A16 20,8.35 v21,9.35 | U$16.A20 24,8.35 v25,9.35 | U$16.A24 28,8.35 v29,9.35 | U$16.A28 32,8.35 v33,9.35 | U$16.A32 36,8.35 v37,9.35 | U$16.A36 40,8.35 v41,9.35 | U$16.A40 44,8.35 v45,9.35 | U$16.A44 48,8.35 v49,9.35 | U$16.A48 52,10.15 v52.8,10.95 | U$16.B4 v6,9.95 | C29.2 | C23.2 45.02,17.63 U$7.P$3 | C5.2 40.43,17.08 U$7.P$7 | C10.2 v42,18.11 | C11.2 39.67,17.79 v39.92,17.79 | U$7.P$13 39.17,18.65 39.15,18.63 C18.2 | 39.19,19.79 39.36,19.79 | 39.36,19.79 v40.08,19.79 | C16.2 39.83,22.65 U$7.P$12 | C15.2 40.83,23.65 U$7.P$8 | C14.2 45,24.54 U$7.P$9 | C20.2 39.67,20.98 U$7.P$6 | C19.2 46.55,22.65 U$7.P$11 | C21.2 46.72,25.32 v46.72,26.43 | C12.2 46,21.12 U$7.P$4 | C6.2 U$7.P$10 | C9.2 46.38,17.25 v46,17.63 | C17.2 39.32,19.83 39.36,19.79 | C13.2 43.71,16.94 U$7.P$2 | R14.1 49.31,12.03 v49.68,12.03 | C22.2 v33.77,15.71 v33.76,15.71 | U$15.P6 37.82,65.01 v38.08,64.75 | C51.2 49.52,34.63 v49.3,34.85
  Bottom 0.305: C85.2 43.77,34.88 v43,35.65 | C79.2 30.97,55.94 | 30.97,55.94 C78.2 | 30.97,55.94 29.7,57.21 29.7,60.05 34.66,65.01 U$15.P6
  Bottom 0.61: C56.2 4.5,15.45 v5.5,14.45 | v1.1,18.25 1.3,18.45 U$13.2 5.3,18.45 5.44,18.59 5.44,20.27 5.84,20.67 | R25.1 4.5,21.95 v5.8,20.65 | U$11.2 23.24,18.95 v23.44,19.15 | C59.2 27.5,17.33 v27.08,16.91 | C52.2 v23.12,16.03 | 18.55,28.4 v17.6,29.35 | U$12.2 5.34,31.57 v5.36,31.55 | C54.2 2.27,25.82 v2.3,25.85
  other vias: 1.1,20.35 12.7,23.05 7.4,68.95 7.5,67.45 10.1,69.05
  pour Route2 (isolate 0.254, no thermals): -1,70.95 57,70.95 57,-1.05 -1,-1.05
  pour Top (isolate 0.381): -0.08,30.99 20.48,30.99 20.56,11.03 0,10.95
  pour Bottom (isolate 0.381): -2,38.95 12,38.95 24,25.95 30,25.95 30,10.95 -2,10.95
L0  (via drill 0.3)
  Top 0.152: U$1.001 50.56,48.71 49.7,47.85 49.7,45.85 v49.3,45.45
  Bottom 0.152: v49.3,45.45 49.1,45.65 47.9,45.65 47.4,46.15 47.4,47.35 47.3,47.45 45.6,47.45 45.5,47.55 43.8,47.55 43.5,47.85 40,47.85 39.86,47.71 26.46,47.71 25.3,46.55 7.9,46.55 6.4,48.05 R46.2
L1
  Top 0.203: R31.2 45.5,54.15 46.16,53.49 U$1.012
L2
  Top 0.203: R32.2 43.9,61.65 44.7,60.85 44.7,54.15 45.76,53.09 U$1.013
LAN_VBUSDET  (via drill 0.3)
  Top 0.152: U$7.011 48.95,21.9 v49,21.95
  Bottom 0.152: SB6.R2 53.7,27.55 SB6.R1 53.5,26.5 SB7.R1 53.45,26.4 v49,21.95
LIND  (via drill 0.3)
  Top 0.152: U$1.002 50.16,48.81 49.3,47.95 49.3,46.35 v47.9,44.95 | R16.2 5.35,47.05 v5.8,47.05
  Bottom 0.152: v47.9,44.95 47.6,45.25 44.9,45.25 43.9,46.25 43.6,46.25 42.4,47.45 40.2,47.45 40.14,47.39 33.54,47.39 33.1,46.95 32.3,46.95 31.5,46.15 6.7,46.15 v5.8,47.05
N$1  (via drill 0.3)
  Top 0.152: U$1.017 44.16,50.41 v44,50.25
  Bottom 0.152: v44,50.25 44,50.09 R1.1
N$2
  Top 0.152: RA1.3 41.08,58.96 42.96,57.08 U$1.020 | U$1.020
N$3
  Top 0.203: Y1.2 27.29,31.7 C1.2 30.45,30.45 31.5,30.45 33,28.95 33.8,28.95 34.16,29.31 U$1.091
N$4
  Top 0.203: Y1.1 27.39,29.7 C2.2 31.35,29.7 32.9,28.15 SB5.L1 | U$1.092 34.56,28.41 SB5.L1 | SB5.L1 34.5,27.95 SB5.L2
N$5
  Top 0.152: U$1.019 43.36,57.16 41.88,58.64 RA1.4
N$6  (via drill 0.3)
  Top 0.127: 18.35,56.05 18.58,55.82
  Top 0.152: v18.35,58.31 18.13,58.08 18.13,56.27 18.35,56.05 | 18.58,55.82 18.75,55.65 DDR3_1.L8 | DDR3_1.L8
  Bottom 0.152: v18.35,58.31 17.03,56.99 17.03,55.77 R2.2
N$7
  Top 0.152: RA3.4 32.5,64.96 33.9,63.56 36.06,63.56 37.66,61.96 37.66,58.7 39.82,56.54 39.82,52.86 39.74,52.78 39.74,51.78 U$1.028
N$8
  Top 0.152: U$1.034 37.36,54.6 35.36,56.6 RA4.3 arc90 RA4.3
N$9
  Top 0.152: 36.16,56.28 37.76,54.68 U$1.033 | 36.16,56.28 | 36.16,56.28 RA4.4 arc90 RA4.4
N$10
  Top 0.152: U$1.027 40.16,52.76 40.14,52.78 40.14,56.7 37.98,58.86 37.98,62.12 36.49,63.61 RA2.1 | RA2.1
N$11
  Top 0.152: U$1.038 35.76,53.4 32.93,56.23 arc-45 32.88,56.34 32.88,56.43 arc-90 33.04,56.59 33.28,56.59 arc90 33.44,56.75 arc90 33.28,56.91 33.04,56.91 arc-90 32.88,57.07 arc-90 33.04,57.23 33.12,57.23 arc90 33.28,57.39 arc90 33.12,57.55 33.04,57.55 arc-90 32.88,57.71 arc-90 33.04,57.87 33.12,57.87 arc90 33.28,58.03 arc90 33.12,58.19 33.04,58.19 arc-90 32.88,58.35 arc-90 33.04,58.51 33.12,58.51 arc90 33.28,58.67 33.28,58.75 arc-90 33.44,58.91 36,58.91 arc90 36.16,59.07 arc90 36,59.23 32.32,59.23 31.76,59.79 RA5.4
N$12
  Top 0.152: 40.46,52.86 40.56,52.76 U$1.026 | RA2.2 37.29,64.98 37.44,64.83 37.44,64.41 38.3,63.55 38.3,59.02 40.46,56.86 40.46,52.86 | 40.46,52.86 | U$1.026
N$13
  Top 0.152: U$1.036 36.56,53.56 34.46,55.66 34.45,55.66 34.08,56.03 34.08,56.43 34.24,56.59 34.96,56.59 35.04,56.67 35.04,56.83 34.96,56.91 34.16,56.91 34.08,56.99 34.08,57.15 34.16,57.23 34.44,57.23 34.56,57.36 RA4.2 arc90 RA4.2
N$14  (via drill 0.3)
  Top 0.152: RA2.4 37.6,66.58 38.94,65.24 38.94,59.34 41.1,57.18 41.1,53.18 41.36,52.92 U$1.024
  Top 0.203: U$1.024 41.36,50.75 v40.96,50.35
N$15
  Top 0.152: 32.12,58.96 32.54,58.54 32.54,56.14 35.36,53.32 U$1.039 | 32.12,58.96 | 32.12,58.96 31.38,58.96 RA5.3
N$16
  Top 0.152: 38.62,59.18 40.78,57.02 40.78,53.02 40.96,52.84 U$1.025 | RA2.3 37.93,65.78 38.62,65.09 38.62,59.18 | 38.62,59.18 | U$1.025
N$17
  Top 0.152: U$1.037 36.16,53.48 33.76,55.88 RA4.1 arc90 RA4.1
N$18
  Top 0.152: RA3.3 32.66,64.16 33.58,63.24 35.9,63.24 37.34,61.8 37.34,58.54 39.5,56.38 39.5,53.02 39.36,52.88 U$1.029
N$19
  Top 0.152: 38.16,54.76 36.7,56.22 | 36.7,56.22 36.7,61.48 35.59,62.59 31.44,62.59 RA3.1 | 36.7,56.22 | 38.16,54.76 | 38.16,54.76 U$1.032
N$20